# EAGLE design BIRDS_X_APRS_v1.3 (EAGLE 9.6.2)

## Sheet 1 of 3: MULTI-SPEC CAMERA MISSION
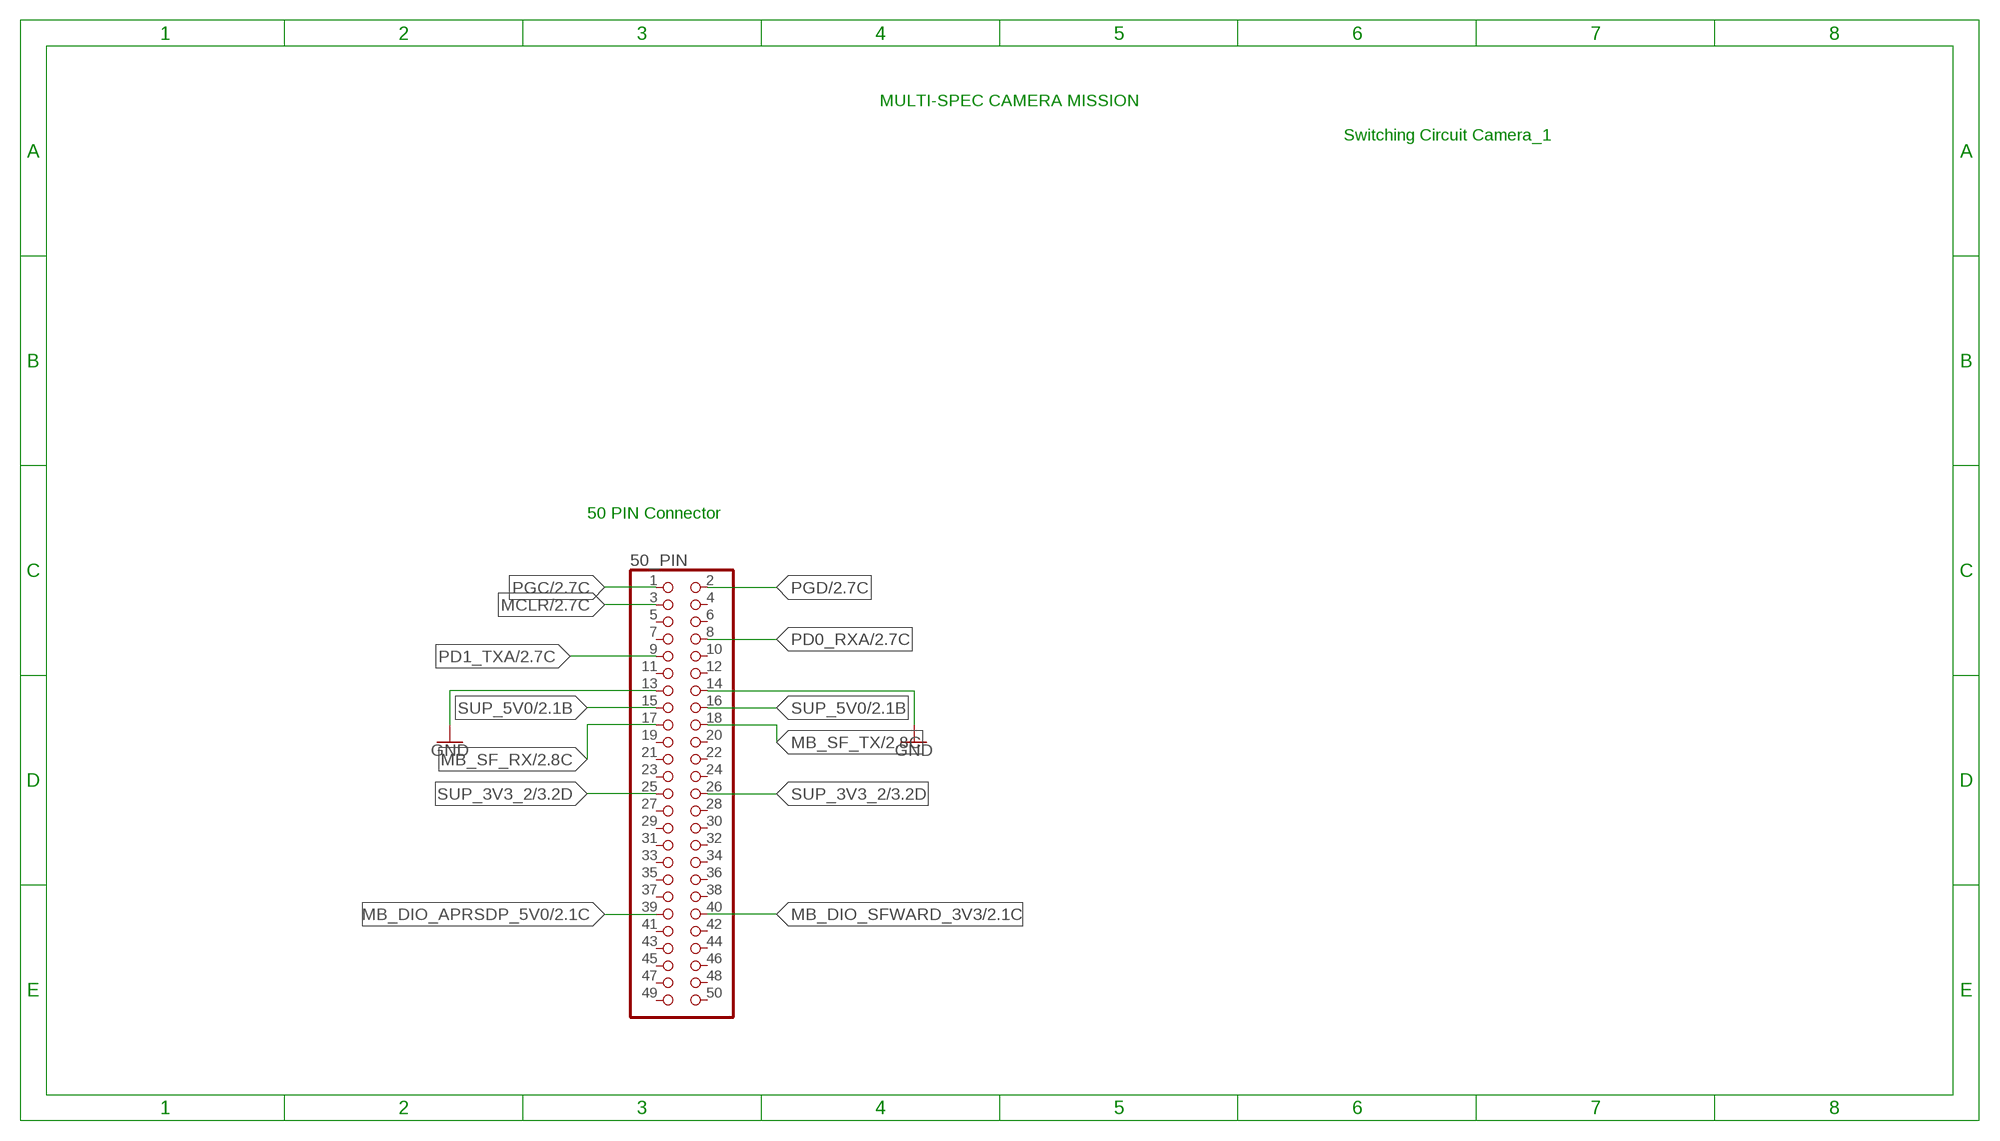
[diagram p0: schematic, sheet 1]

### Parts
50_PIN  PINHD-2X25_2.00  [2X25M]

### Nets
GND: 50_PIN.13 50_PIN.14 ; also sheet 2,3
MB_DIO_APRSDP_5V0: 50_PIN.39 ; also sheet 2
MB_DIO_SFWARD_3V3: 50_PIN.40 ; also sheet 2,3
MB_SF_RX/2.8C: 50_PIN.17
MB_SF_TX/2.8C: 50_PIN.18
MCLR: 50_PIN.3 ; also sheet 2,3
PD0_RXA: 50_PIN.8 ; also sheet 2
PD1_TXA: 50_PIN.9 ; also sheet 2
PGC: 50_PIN.1 ; also sheet 2,3
PGD: 50_PIN.2 ; also sheet 2,3
SUP_3V3_2: 50_PIN.25 50_PIN.26 ; also sheet 3
SUP_5V0: 50_PIN.15 50_PIN.16 ; also sheet 2
Unconnected: 50_PIN.4 50_PIN.5 50_PIN.6 50_PIN.7 50_PIN.10 50_PIN.11 50_PIN.12 50_PIN.19 50_PIN.20 50_PIN.21 50_PIN.22 50_PIN.23 50_PIN.24 50_PIN.27 50_PIN.28 50_PIN.29 50_PIN.30 50_PIN.31 50_PIN.32 50_PIN.33 50_PIN.34 50_PIN.35 50_PIN.36 50_PIN.37 50_PIN.38 50_PIN.41 50_PIN.42 50_PIN.43 50_PIN.44 50_PIN.45 50_PIN.46 50_PIN.47 50_PIN.48 50_PIN.49 50_PIN.50

### Notes on the sheet
- MULTI-SPEC CAMERA MISSION
- Switching Circuit Camera_1
- 50 PIN Connector

## Sheet 2 of 3: APRS/DP MISSION
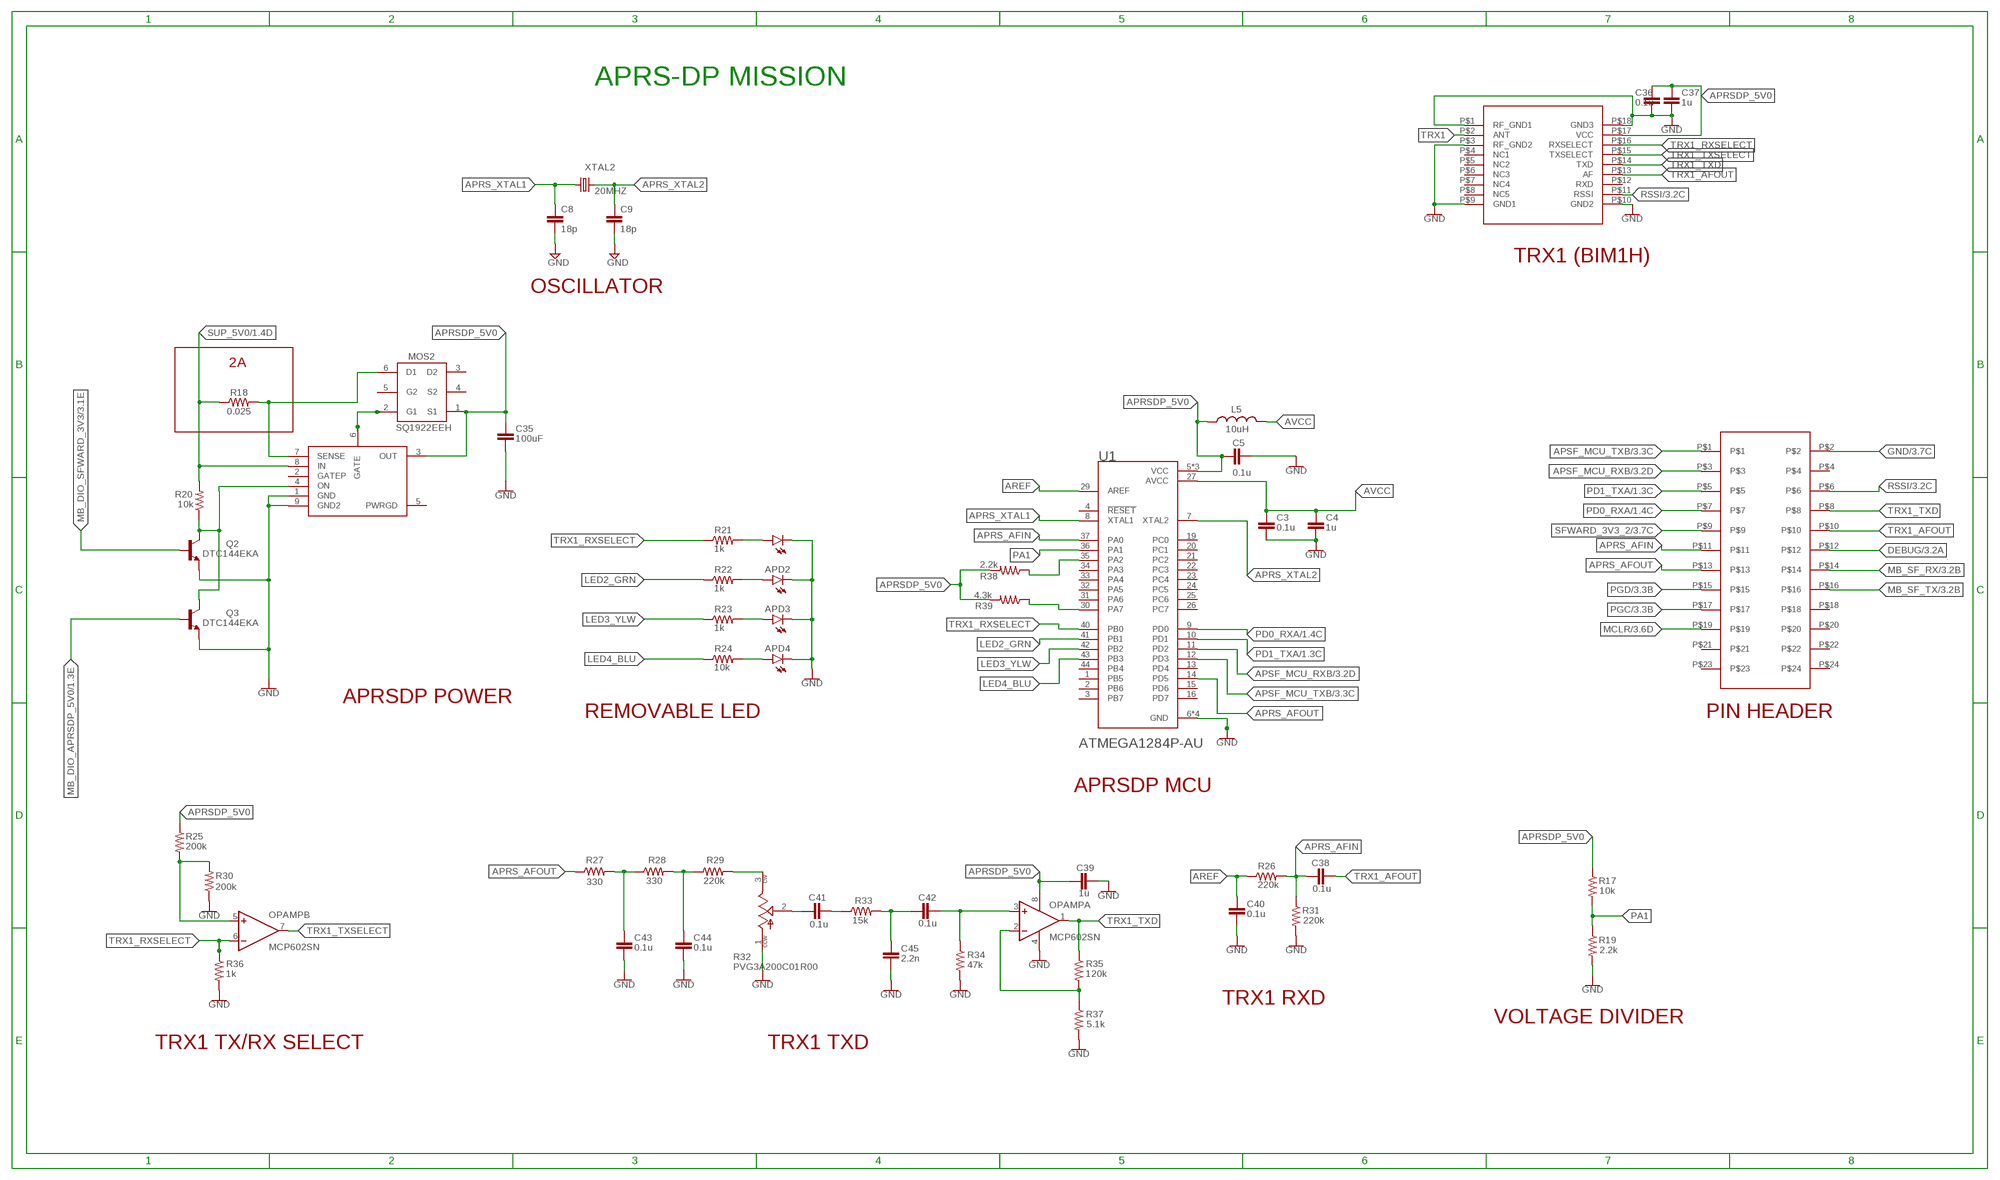
[diagram p1: schematic, sheet 2]

### Parts
APD1  LEDSML0603  [SML0603]
APD2  LEDSML0603  [SML0603]
APD3  LEDSML0603  [SML0603]
APD4  LEDSML0603  [SML0603]
C3  0.1u  CC0603  [C0603]
C4  1u  CC0603  [C0603]
C5  0.1u  CC0603  [C0603]
C8  18p  C  [C0805]
C9  18p  C  [C0805]
C35  100uF  C0805(2012)  [C0805]
C36  0.1u  CC0603  [C0603]
C37  1u  CC0603  [C0603]
C38  0.1u  CC0603  [C0603]
C39  1u  CC0603  [C0603]
C40  0.1u  CC0603  [C0603]
C41  0.1u  CC0603  [C0603]
C42  0.1u  CC0603  [C0603]
C43  0.1u  CC0603  [C0603]
C44  0.1u  CC0603  [C0603]
C45  2.2n  CC0603  [C0603]
JP1  RAB_ACCESS  [RAB_ACCESS]
L5  10uH  L-USL2012C  [L2012C]
MOS2  SQ1922EEH  [SOT65P210X110-6N]
OPAMP  MCP602SN  [SO08]
Q2  DTC144EKA  [SOT346-R]
Q3  DTC144EKA  [SOT346-R]
R17  10k  R-US_R0603  [R0603]
R18  0.025  R-US_R0805  [R0805]
R19  2.2k  R-US_R0603  [R0603]
R20  10k  R-US_R0603  [R0603]
R21  1k  R-US_R0603  [R0603]
R22  1k  R-US_R0603  [R0603]
R23  1k  R-US_R0603  [R0603]
R24  10k  R-US_R0603  [R0603]
R25  200k  R-US_R0603  [R0603]
R26  220k  R-US_R0603  [R0603]
R27  330  R-US_R0603  [R0603]
R28  330  R-US_R0603  [R0603]
R29  220k  R-US_R0603  [R0603]
R30  200k  R-US_R0603  [R0603]
R31  220k  R-US_R0603  [R0603]
R32  PVG3A200C01R00  [TRIM_PVG3A200C01R00]
R33  15k  R-US_R0603  [R0603]
R34  47k  R-US_R0603  [R0603]
R35  120k  R-US_R0603  [R0603]
R36  1k  R-US_R0603  [R0603]
R37  5.1k  R-US_R0603  [R0603]
R38  2.2k  R-US_R0603  [R0603]
R39  4.3k  R-US_R0603  [R0603]
TRX1  BIM1H  [BIM1H]
U1  ATMEGA1284P-AU  [QFP80P1200X1200X120-44N]
U$1  BIRDS5_LTC4361  [BIRDS5_LTC4361]
XTAL2  20MHZ  CRYSTALSM49  [SM49]

### Nets
APRS_AFIN: C38.1 JP1.P$11 R26.2 R31.1 U1.37(PA0)
APRS_AFOUT: JP1.P$13 R27.1 U1.14(PD5)
APRS_XTAL1: C8.1 U1.8(XTAL1) XTAL2.1
APRS_XTAL2: C9.1 U1.7(XTAL2) XTAL2.2
APRSDP_5V0: C5.2 C35.1 C36.1 C37.1 C39.1 L5.1 MOS2.1(S1) OPAMP.8(P:V+) R17.1 R25.1 R38.2 R39.2 TRX1.P$17(VCC) U1.5(VCC) U1.17(VCC) U1.38(VCC) U$1.3(OUT)
APSF_MCU_RXB: JP1.P$3 ; also sheet 3
APSF_MCU_RXB/3.2D: U1.11(PD2)
APSF_MCU_TXB: JP1.P$1 ; also sheet 3
APSF_MCU_TXB/3.3C: U1.12(PD3)
AREF: C40.1 R26.1 U1.29(AREF)
AVCC: C3.1 C4.1 L5.2 U1.27(AVCC)
DEBUG: JP1.P$12 ; also sheet 3
GATE4: MOS2.2(G1) U$1.6(GATE)
GND: APD1.C APD2.C APD3.C APD4.C C3.2 C4.2 C5.1 C8.2 C9.2 C35.2 C36.2 C37.2 C39.2 C40.2 C43.2 C44.2 C45.2 JP1.P$2 OPAMP.4(P:V-) Q2.1(E) Q3.1(E) R19.2 R30.1 R31.2 R32.1(CCW) R34.2 R36.2 R37.2 TRX1.P$1(RF_GND1) TRX1.P$3(RF_GND2) TRX1.P$9(GND1) TRX1.P$10(GND2) TRX1.P$18(GND3) U1.6(GND) U1.18(GND) U1.28(GND) U1.39(GND) U$1.1(GND) U$1.9(GND2) ; also sheet 1,3
LED2_GRN: R22.1 U1.41(PB1)
LED3_YLW: R23.1 U1.42(PB2)
LED4_BLU: R24.1 U1.43(PB3)
MB_DIO_APRSDP_5V0: Q3.2(B) ; also sheet 1
MB_DIO_SFWARD_3V3: Q2.2(B) ; also sheet 1,3
MB_SF_RX: JP1.P$14 ; also sheet 3
MB_SF_TX: JP1.P$16 ; also sheet 3
MCLR: JP1.P$19 ; also sheet 1,3
N$1: R38.1 U1.35(PA2)
N$3: R39.1 U1.30(PA7)
N$10: R29.2 R32.3(CW)
N$12: APD1.A R21.2
N$13: APD2.A R22.2
N$14: APD3.A R23.2
N$15: APD4.A R24.2
N$16: C43.1 R27.2 R28.1
N$17: C44.1 R28.2 R29.1
N$18: C42.1 C45.1 R33.2
N$19: C41.2 R33.1
N$20: OPAMP.2(A:-IN) R35.2 R37.1
N$21: OPAMP.5(B:+IN) R25.2 R30.2
N$22: C41.1 R32.2(WIPER)
ON4: Q2.3(C) Q3.3(C) R20.1 U$1.4(ON)
OPAMP_A+: C42.2 OPAMP.3(A:+IN) R34.1
PA1: R17.2 R19.1 U1.36(PA1)
PD0_RXA: JP1.P$7 ; also sheet 1
PD0_RXA/1.4C: U1.9(PD0)
PD1_TXA: JP1.P$5 ; also sheet 1
PD1_TXA/1.3C: U1.10(PD1)
PGC: JP1.P$17 ; also sheet 1,3
PGD: JP1.P$15 ; also sheet 1,3
RSSI: JP1.P$6 TRX1.P$11(RSSI) ; also sheet 3
SENSE4: MOS2.6(D1) R18.2 U$1.7(SENSE)
SFWARD_3V3_2: JP1.P$9 ; also sheet 3
SUP_5V0: R18.1 R20.2 U$1.8(IN) ; also sheet 1
TRX1: TRX1.P$2(ANT) ; also sheet 3
TRX1_AFOUT: C38.2 JP1.P$10 TRX1.P$13(AF)
TRX1_RXSELECT: OPAMP.6(B:-IN) R21.1 R36.1 TRX1.P$16(RXSELECT) U1.40(PB0)
TRX1_TXD: JP1.P$8 OPAMP.1(A:OUT) R35.1 TRX1.P$14(TXD)
TRX1_TXSELECT: OPAMP.7(B:OUT) TRX1.P$15(TXSELECT)
Unconnected: JP1.P$4 JP1.P$18 JP1.P$20 JP1.P$21 JP1.P$22 JP1.P$23 JP1.P$24 MOS2.3(D2) MOS2.4(S2) MOS2.5(G2) TRX1.P$4(NC1) TRX1.P$5(NC2) TRX1.P$6(NC3) TRX1.P$7(NC4) TRX1.P$8(NC5) TRX1.P$12(RXD) U1.1(PB5) U1.2(PB6) U1.3(PB7) U1.4(!RESET) U1.13(PD4) U1.15(PD6) U1.16(PD7) U1.19(PC0) U1.20(PC1) U1.21(PC2) U1.22(PC3) U1.23(PC4) U1.24(PC5) U1.25(PC6) U1.26(PC7) U1.31(PA6) U1.32(PA5) U1.33(PA4) U1.34(PA3) U1.44(PB4) U$1.2(GATEP) U$1.5(PWRGD)

### Notes on the sheet
- APRS-DP MISSION
- TRX1 (BIM1H)
- OSCILLATOR
- 2A
- APRSDP POWER
- REMOVABLE LED | PIN HEADER
- APRSDP MCU
- TRX1 RXD
- VOLTAGE DIVIDER
- TRX1 TX/RX SELECT | TRX1 TXD

## Sheet 3 of 3: SF-WARD MISSION
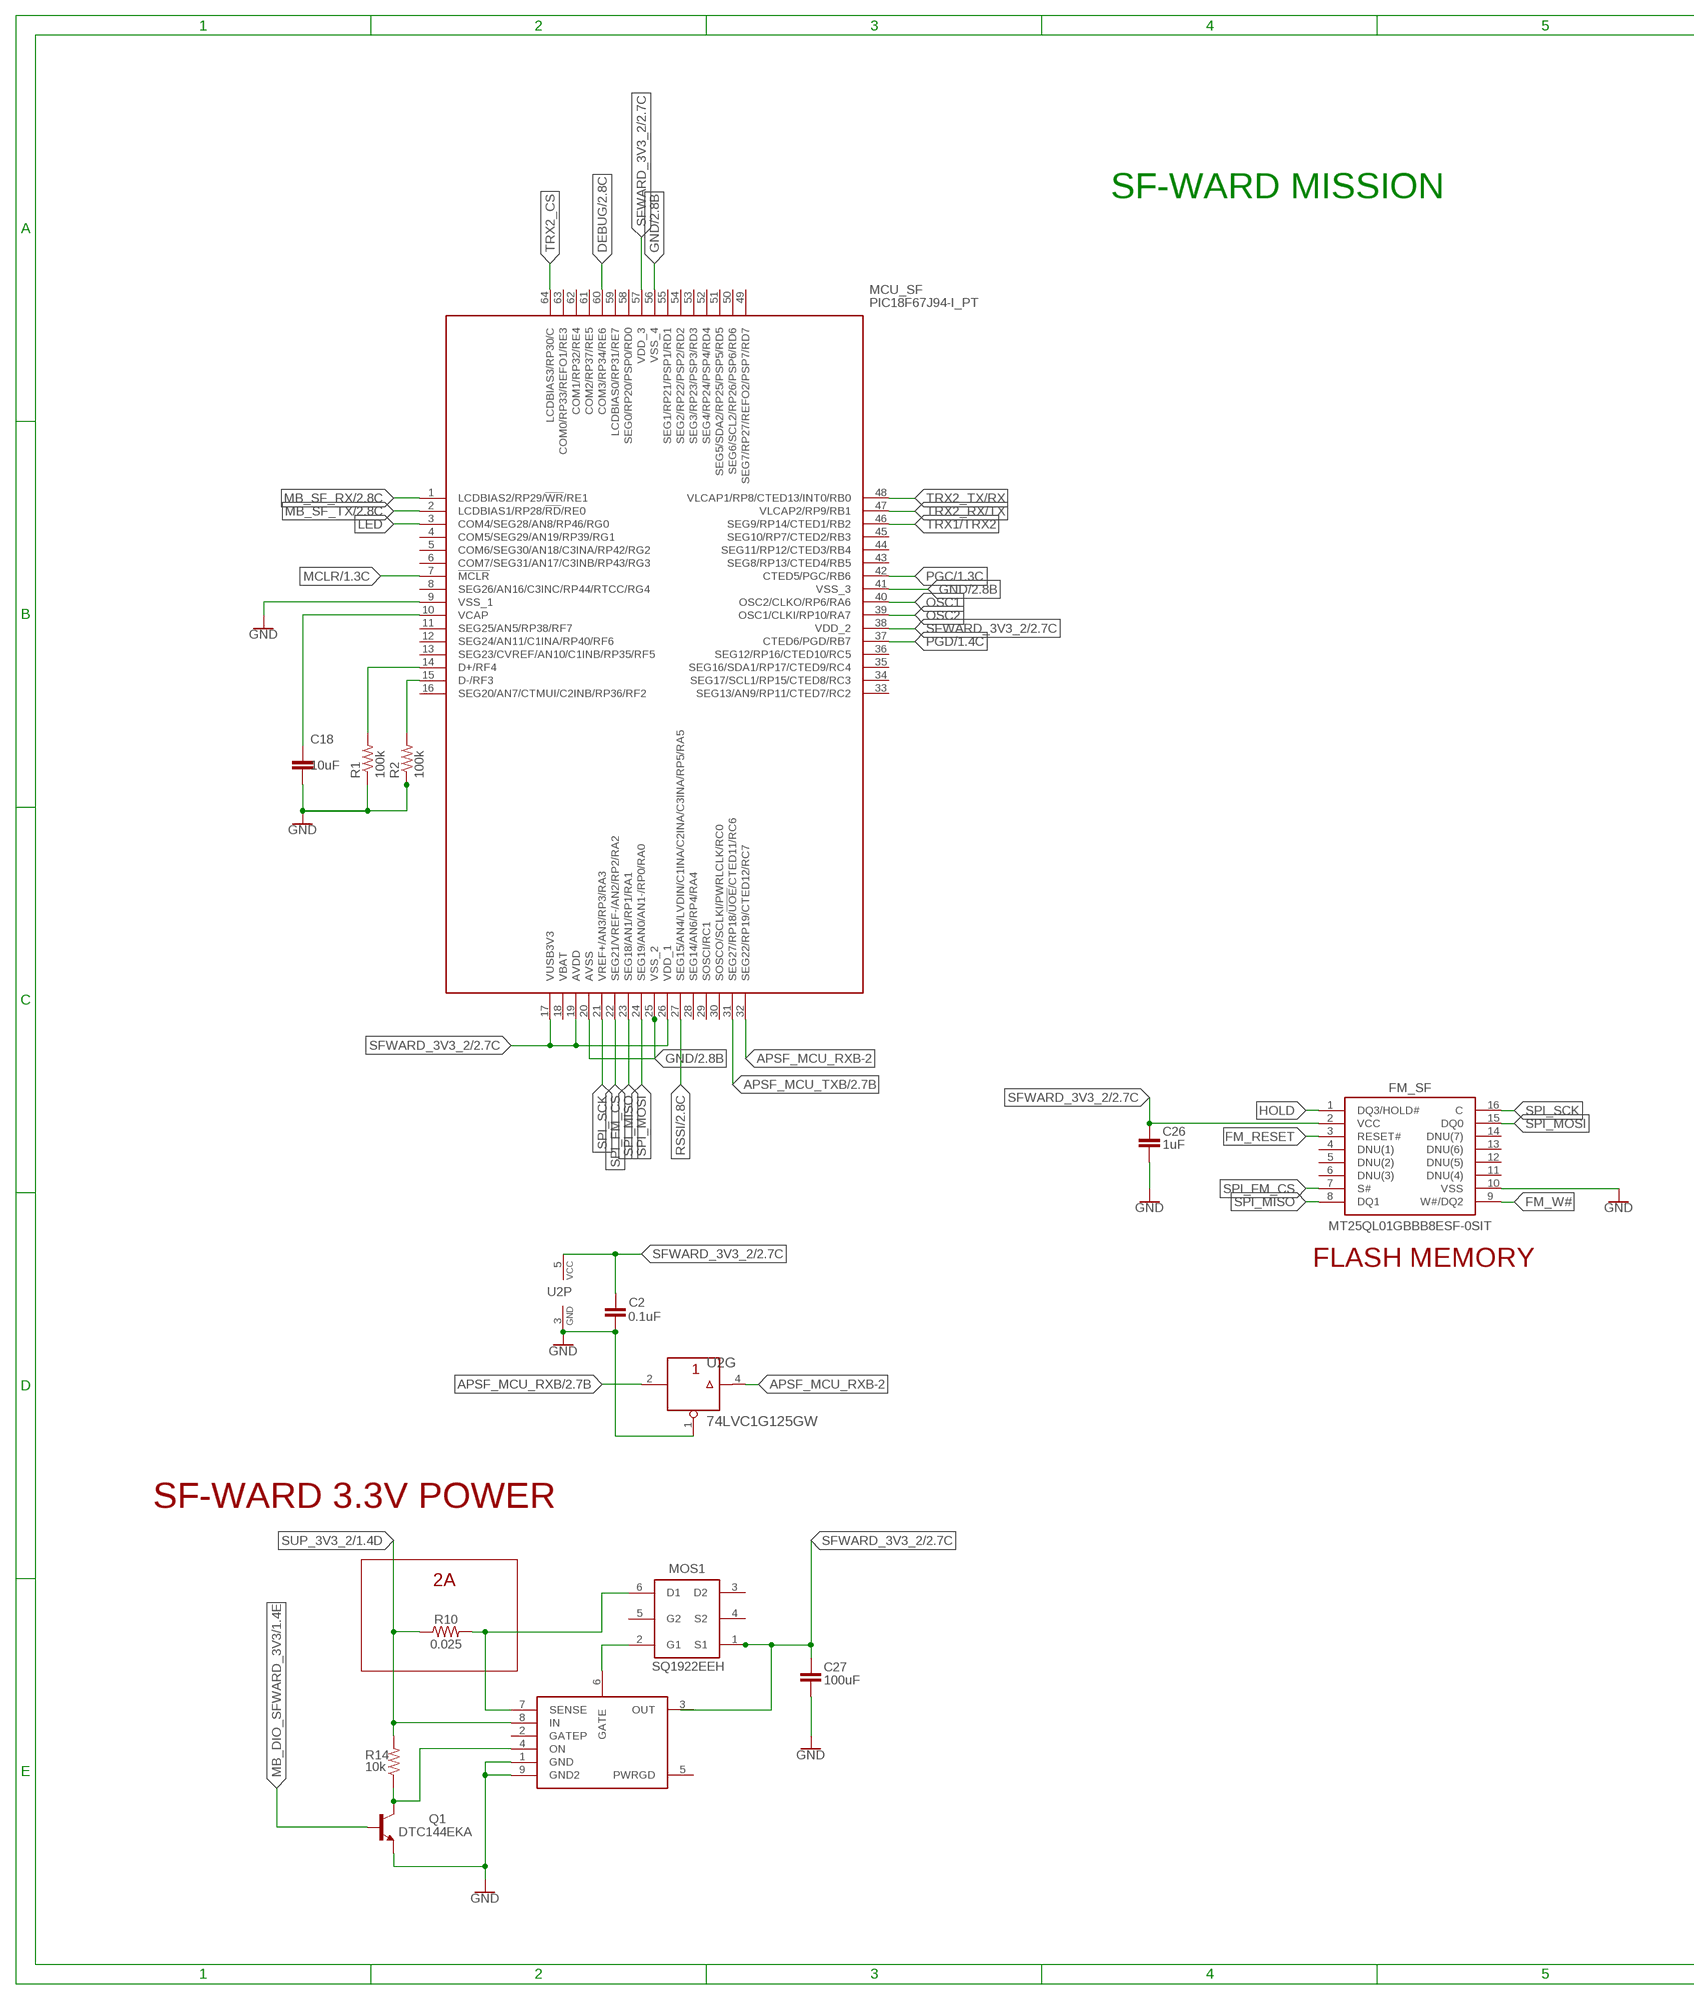
[diagram p2: schematic, sheet 3, part 1 of 2]
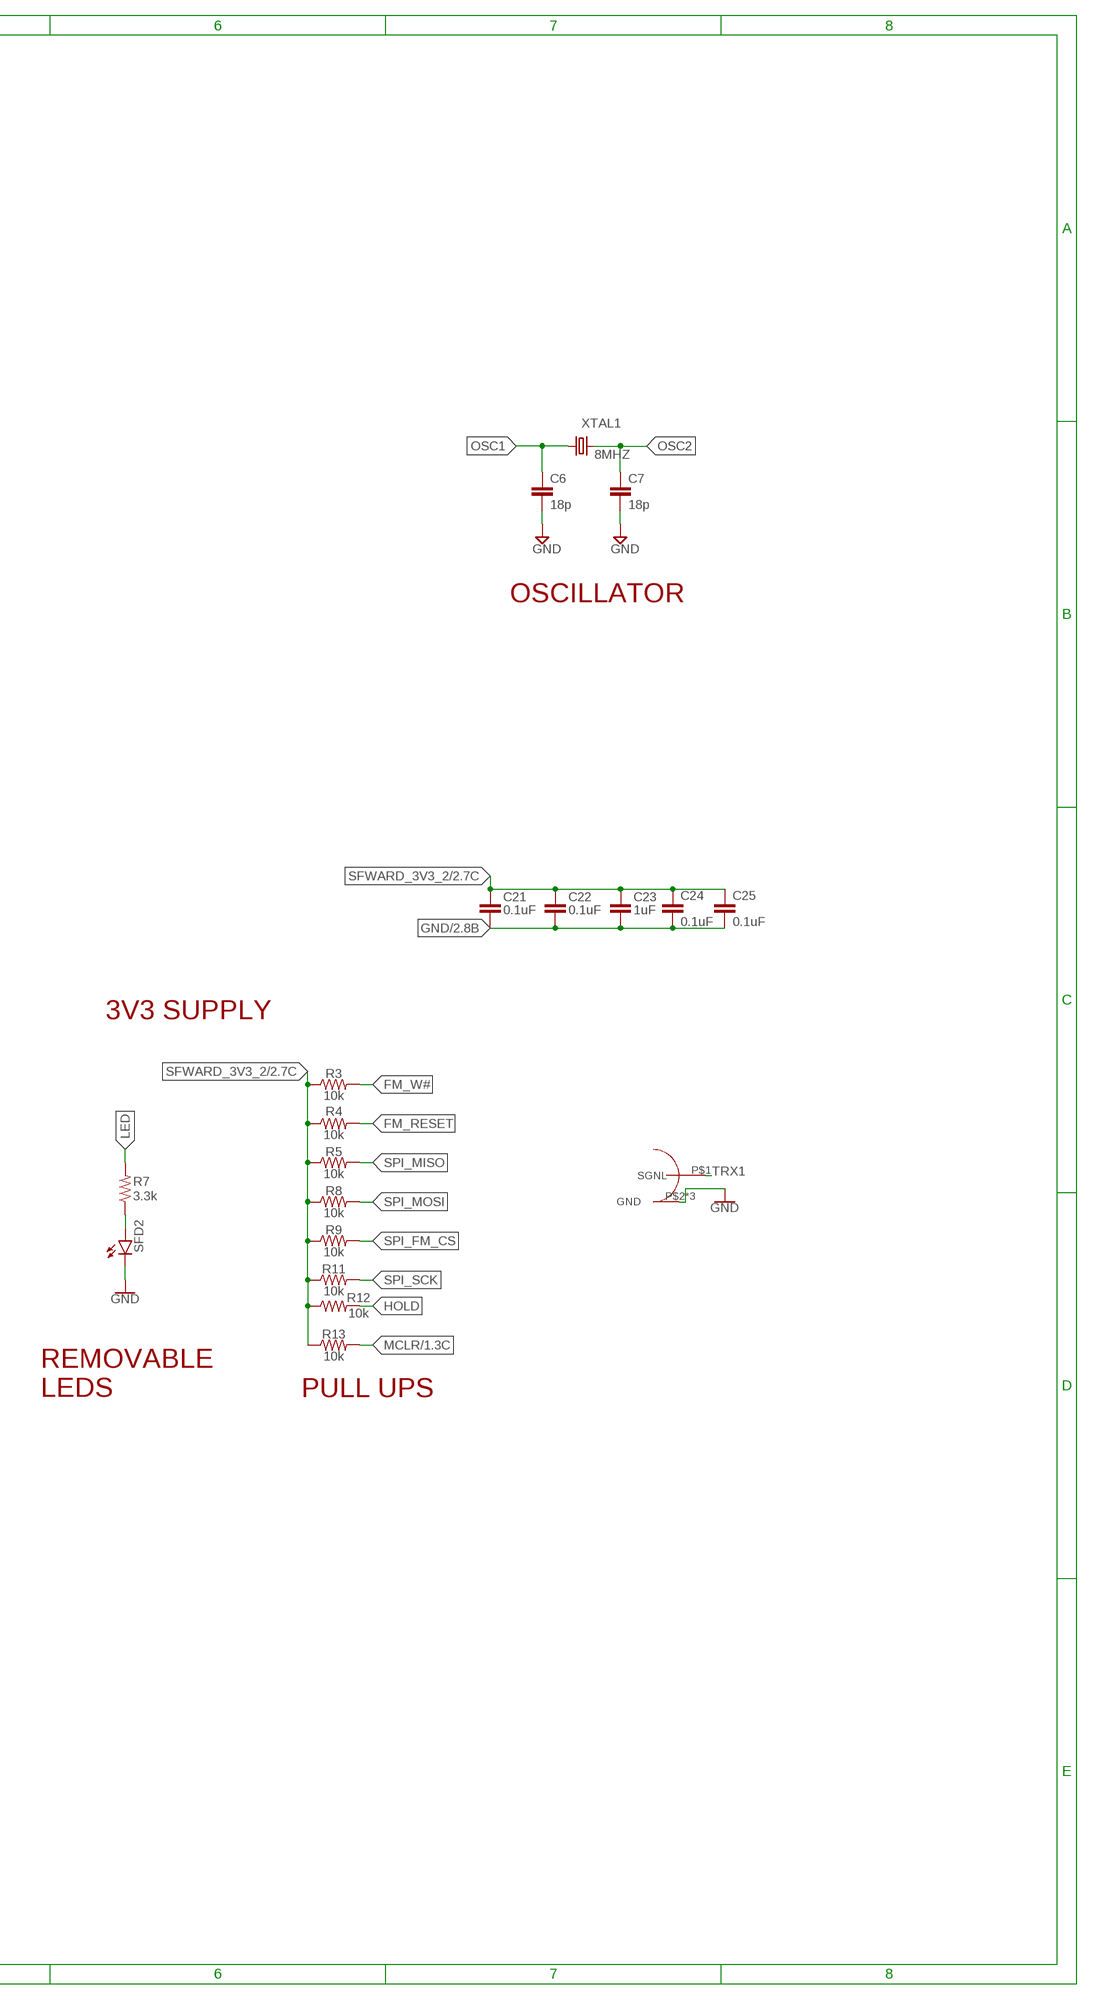
[diagram p3: schematic, sheet 3, part 2 of 2]

### Parts
C2  0.1uF  CC0603  [C0603]
C6  18p  C  [C0805]
C7  18p  C  [C0805]
C18  10uF  C-EUC0603  [C0603]
C21  0.1uF  C-EUC0603  [C0603]
C22  0.1uF  C-EUC0603  [C0603]
C23  1uF  C-EUC0603  [C0603]
C24  0.1uF  C-EUC0603  [C0603]
C25  0.1uF  C-EUC0603  [C0603]
C26  1uF  C-EUC0603  [C0603]
C27  100uF  C0805(2012)  [C0805]
FM_SF  MT25QL01GBBB8ESF-0SIT  [SOIC127P1032X265-16N]
MCU_SF  PIC18F67J94-I_PT  [QFP50P1200X1200X120-64N]
MMCX_908_222101T  MMCX_908_222101T  [MMCX_908_222101T]
MOS1  SQ1922EEH  [SOT65P210X110-6N]
Q1  DTC144EKA  [SOT346-R]
R1  100k  R-US_R0603  [R0603]
R2  100k  R-US_R0603  [R0603]
R3  10k  R-US_R0603  [R0603]
R4  10k  R-US_R0603  [R0603]
R5  10k  R-US_R0603  [R0603]
R7  3.3k  R-US_R0603  [R0603]
R8  10k  R-US_R0603  [R0603]
R9  10k  R-US_R0603  [R0603]
R10  0.025  R0805(2012)  [R0805]
R11  10k  R-US_R0603  [R0603]
R12  10k  R-US_R0603  [R0603]
R13  10k  R-US_R0603  [R0603]
R14  10k  R-US_R0603  [R0603]
SFD2  LEDCHIPLED_0603  [CHIPLED_0603]
U2  74LVC1G125GW  [SOT353-1]
U$3  BIRDS5_LTC4361  [BIRDS5_LTC4361]
XTAL1  8MHZ  CRYSTALSM49  [SM49]

### Nets
APSF_MCU_RXB: U2.2(G:A) ; also sheet 2
APSF_MCU_RXB-2: MCU_SF.32(SEG22/RP19/CTED12/RC7) U2.4(G:Y)
APSF_MCU_TXB: MCU_SF.31(SEG27/RP18/!UOE!/CTED11/RC6) ; also sheet 2
DEBUG: MCU_SF.60(COM3/RP34/RE6) ; also sheet 2
FM_RESET: FM_SF.3(RESET#) R4.2
FM_W#: FM_SF.9(W#/DQ2) R3.2
GATE3: MOS1.2(G1) U$3.6(GATE)
GND: C2.1 C6.2 C7.2 C18.2 C21.2 C22.2 C23.2 C24.2 C25.2 C26.2 C27.2 FM_SF.10(VSS) MCU_SF.9(VSS_1) MCU_SF.20(AVSS) MCU_SF.25(VSS_2) MCU_SF.41(VSS_3) MCU_SF.56(VSS_4) MMCX_908_222101T.P$2(GND) MMCX_908_222101T.P$3(GND) MMCX_908_222101T.P$4(GND) Q1.1(E) R1.1 R2.1 SFD2.C U2.1(G:OEN) U2.3(P:GND) U$3.1(GND) U$3.9(GND2) ; also sheet 1,2
HOLD: FM_SF.1(DQ3/HOLD#) R12.2
LED: MCU_SF.3(COM4/SEG28/AN8/RP46/RG0) R7.2
MB_DIO_SFWARD_3V3: Q1.2(B) ; also sheet 1,2
MB_SF_RX: MCU_SF.1(LCDBIAS2/RP29/!WR!/RE1) ; also sheet 2
MB_SF_TX: MCU_SF.2(LCDBIAS1/RP28/!RD!/RE0) ; also sheet 2
MCLR: MCU_SF.7(!MCLR) R13.2 ; also sheet 1,2
N$2: C18.1 MCU_SF.10(VCAP)
N$7: MCU_SF.14(D+/RF4) R1.2
N$8: MCU_SF.15(D-/RF3) R2.2
N$11: R7.1 SFD2.A
ON3: Q1.3(C) R14.1 U$3.4(ON)
OSC1: C6.1 MCU_SF.40(OSC2/CLKO/RP6/RA6) XTAL1.1
OSC2: C7.1 MCU_SF.39(OSC1/CLKI/RP10/RA7) XTAL1.2
PGC: MCU_SF.42(CTED5/PGC/RB6) ; also sheet 1,2
PGD: MCU_SF.37(CTED6/PGD/RB7) ; also sheet 1,2
RSSI: MCU_SF.27(SEG15/AN4/LVDIN/C1INA/C2INA/C3INA/RP5/RA5) ; also sheet 2
SENSE3: MOS1.6(D1) R10.2 U$3.7(SENSE)
SFWARD_3V3_2: C2.2 C21.1 C22.1 C23.1 C24.1 C25.1 C26.1 C27.1 FM_SF.2(VCC) MCU_SF.17(VUSB3V3) MCU_SF.19(AVDD) MCU_SF.26(VDD_1) MCU_SF.38(VDD_2) MCU_SF.57(VDD_3) MOS1.1(S1) R3.1 R4.1 R5.1 R8.1 R9.1 R11.1 R12.1 R13.1 U2.5(P:VCC) U$3.3(OUT) ; also sheet 2
SPI_FM_CS: FM_SF.7(S#) MCU_SF.22(SEG21/VREF-/AN2/RP2/RA2) R9.2
SPI_MISO: FM_SF.8(DQ1) MCU_SF.23(SEG18/AN1/RP1/RA1) R5.2
SPI_MOSI: FM_SF.15(DQ0) MCU_SF.24(SEG19/AN0/AN1-/RP0/RA0) R8.2
SPI_SCK: FM_SF.16(C) MCU_SF.21(VREF+/AN3/RP3/RA3) R11.2
SUP_3V3_2: R10.1 R14.2 U$3.8(IN) ; also sheet 1
TRX1: MMCX_908_222101T.P$1(SGNL) ; also sheet 2
TRX1/TRX2: MCU_SF.46(SEG9/RP14/CTED1/RB2)
TRX2_CS: MCU_SF.64(LCDBIAS3/RP30/C)
TRX2_RX/TX: MCU_SF.47(VLCAP2/RP9/RB1)
TRX2_TX/RX: MCU_SF.48(VLCAP1/RP8/CTED13/INT0/RB0)
Unconnected: FM_SF.4(DNU(1)) FM_SF.5(DNU(2)) FM_SF.6(DNU(3)) FM_SF.11(DNU(4)) FM_SF.12(DNU(5)) FM_SF.13(DNU(6)) FM_SF.14(DNU(7)) MCU_SF.4(COM5/SEG29/AN19/RP39/RG1) MCU_SF.5(COM6/SEG30/AN18/C3INA/RP42/RG2) MCU_SF.6(COM7/SEG31/AN17/C3INB/RP43/RG3) MCU_SF.8(SEG26/AN16/C3INC/RP44/RTCC/RG4) MCU_SF.11(SEG25/AN5/RP38/RF7) MCU_SF.12(SEG24/AN11/C1INA/RP40/RF6) MCU_SF.13(SEG23/CVREF/AN10/C1INB/RP35/RF5) MCU_SF.16(SEG20/AN7/CTMUI/C2INB/RP36/RF2) MCU_SF.18(VBAT) MCU_SF.28(SEG14/AN6/RP4/RA4) MCU_SF.29(SOSCI/RC1) MCU_SF.30(SOSCO/SCLKI/PWRLCLK/RC0) MCU_SF.33(SEG13/AN9/RP11/CTED7/RC2) MCU_SF.34(SEG17/SCL1/RP15/CTED8/RC3) MCU_SF.35(SEG16/SDA1/RP17/CTED9/RC4) MCU_SF.36(SEG12/RP16/CTED10/RC5) MCU_SF.43(SEG8/RP13/CTED4/RB5) MCU_SF.44(SEG11/RP12/CTED3/RB4) MCU_SF.45(SEG10/RP7/CTED2/RB3) MCU_SF.49(SEG7/RP27/REFO2/PSP7/RD7) MCU_SF.50(SEG6/SCL2/RP26/PSP6/RD6) MCU_SF.51(SEG5/SDA2/RP25/PSP5/RD5) MCU_SF.52(SEG4/RP24/PSP4/RD4) MCU_SF.53(SEG3/RP23/PSP3/RD3) MCU_SF.54(SEG2/RP22/PSP2/RD2) MCU_SF.55(SEG1/RP21/PSP1/RD1) MCU_SF.58(SEG0/RP20/PSP0/RD0) MCU_SF.59(LCDBIAS0/RP31/RE7) MCU_SF.61(COM2/RP37/RE5) MCU_SF.62(COM1/RP32/RE4) MCU_SF.63(COM0/RP33/REFO1/RE3) MOS1.3(D2) MOS1.4(S2) MOS1.5(G2) U$3.2(GATEP) U$3.5(PWRGD)

### Notes on the sheet
- SF-WARD MISSION
- OSCILLATOR
- 3V3 SUPPLY
- FLASH MEMORY
- REMOVABLE
  LEDS
- PULL UPS
- SF-WARD 3.3V POWER
- 2A

## Library data of the parts
50_PIN = pinhead-1:PINHD-2X25: PIN HEADER
APD1-APD4 SFD2 = led:LED: LED OSRAM: - CHIPLED LG R971, LG N971, LY N971, LG Q971, LY Q971, LO R971, LY R971 LH N974, LH R974 LS Q976, LO Q976, LY Q976 LO Q996 - Hyper CHIPLED LW Q18S LB Q993, LB Q99A, LB R99A - SideLED LS A670, LO A670, LY A670, LG A670, LP A670 LB A673, LV A673, LT A673, LW A673 LH A674 LY A675 LS A676, LA A676, LO A676, LY A676, LW A676 LS A679, LY A679, LG A679 - Hyper Micro SIDELED® LS Y876, LA Y876, LO Y876, LY Y876 LT Y87S - SmartLED LW L88C, LW L88S LB L89C, LB L89S, LG L890 LS L89K, LO L89K, LY L89K LS L896, LA L896, LO L896, LY L896 - TOPLED LS T670, LO T670, LY T670, LG T670, LP T670 LSG T670, LSP T670, LSY T670, LOP T670, LYG T670 LG T671, LOG T671, LSG T671 LB T673, LV T673, LT T673, LW T673 LH T674 LS T676, LA T676, LO T676, LY T676, LB T676, LH T676, LSB T676, LW T676 LB T67C, LV T67C, LT T67C, LS T67K, LO T67K, LY T67K, LW E67C LS E67B, LA E67B, LO E67B, LY E67B, LB E67C, LV E67C, LT E67C LW T67C LS T679, LY T679, LG T679 LS T770, LO T770, LY T770, LG T770, LP T770 LB T773, LV T773, LT T773, LW T773 LH T774 LS E675, LA E675, LY E675, LS T675 LS T776, LA T776, LO T776, LY T776, LB T776 LHGB T686 LT T68C, LB T68C - Hyper Mini TOPLED® LB M676 - Mini TOPLED Santana® LG M470 LS M47K, LO M47K, LY M47K Source: http://www.osram.convergy.de LUXEON: - LUMILED® LXK2-PW12-R00, LXK2-PW12-S00, LXK2-PW14-U00, LXK2-PW14-V00 LXK2-PM12-R00, LXK2-PM12-S00, LXK2-PM14-U00 LXK2-PE12-Q00, LXK2-PE12-R00, LXK2-PE12-S00, LXK2-PE14-T00, LXK2-PE14-U00 LXK2-PB12-K00, LXK2-PB12-L00, LXK2-PB12-M00, LXK2-PB14-N00, LXK2-PB14-P00, LXK2-PB14-Q00 LXK2-PR12-L00, LXK2-PR12-M00, LXK2-PR14-Q00, LXK2-PR14-R00 LXK2-PD12-Q00, LXK2-PD12-R00, LXK2-PD12-S00 LXK2-PH12-R00, LXK2-PH12-S00 LXK2-PL12-P00, LXK2-PL12-Q00, LXK2-PL12-R00 Source: www.luxeon.com KINGBRIGHT: KA-3528ASYC Source: www.kingbright.com
C2-C9 C36-C45 = eagle-ltspice:C: CAPACITOR, European symbol; SPICEMODEL: NONE; SPICEPREFIX: C
C18 C21-C26 = rcl:C-EU: CAPACITOR, European symbol; SPICEPREFIX: C
C27 C35 = BIRDS3_CAM_MSN:C0805(2012)
FM_SF = BIRDS3_CAM_MSN:MT25QL01GBBB8ESF-0SIT: IC FLASH 1GBIT 108MHZ 16SOIC Source: Datasheet <https://www.micron.com/~/media/documents/products/data-sheet/nor-flash/serial-nor/mt25q/die-rev-b/mt25q_qlkt_l_01g_bbb_0.pdf>; DESCRIPTION: IC FLASH 1GBIT 108MHZ 16SOIC; HEIGHT: 2.65mm; MANUFACTURER_NAME: Micron; MANUFACTURER_PART_NUMBER: MT25QL01GBBB8ESF-0SIT; SUPPLIER_NAME: RS
JP1 = BIRDS_4_general_components_library:RAB_ACCESS
L5 = rcl:L-US: INDUCTOR, American symbol; SPICEPREFIX: L
MCU_SF = PIC18F67J94-I_PT:PIC18F67J94-I_PT: MCU 8-Bit 128K Flash LCD USB XLP TQFP64 Microchip PIC18F67J94-I/PT, 8bit PIC Microcontroller, 64MHz, 128 kB Flash, 64-Pin TQFP Source: Datasheet <http://uk.rs-online.com/web/p/products/8233908>; ALLIED_NUMBER: 70470236; ALLIED_PRICE-STOCK: https://www.alliedelec.com/microchip-technology-inc-pic18f67j94-i-pt/70470236/; DESCRIPTION: MCU 8-Bit 128K Flash LCD USB XLP TQFP64 Microchip PIC18F67J94-I/PT, 8bit PIC Microcontroller, 64MHz, 128 kB Flash, 64-Pin TQFP; HEIGHT: 1.2mm; MANUFACTURER_NAME: Microchip; MANUFACTURER_PART_NUMBER: PIC18F67J94-I/PT; MOUSER_PART_NUMBER: 579-PIC18F67J94-I/PT; MOUSER_PRICE-STOCK: https://www.mouser.com/Search/Refine.aspx?Keyword=579-PIC18F67J94-I%2FPT; RS_PART_NUMBER: 1652172; RS_PRICE-STOCK: http://uk.rs-online.com/web/p/products/1652172
MMCX_908_222101T = BIRDS_4_general_components_library:MMCX_908_222101T
MOS1 MOS2 = BIRDS3_CAM_MSN:SQ1922EEH
OPAMP = linear:MCP602: Single Op Amp 2.7V to 6.0V Single Supply CMOS Source: http://ww1.microchip.com/downloads/en/DeviceDoc/21314g.pdf
Q1-Q3 = BIRDS3_CAM_MSN:DTC144EKA
R1-R5 R7-R9 R11-R14 R17-R31 R33-R39 = rcl:R-US_: RESISTOR, American symbol; SPICEPREFIX: R
R10 = BIRDS3_CAM_MSN:R0805(2012)
R32 = PVG3A200C01R00:PVG3A200C01R00: Res Cermet Trimmer 20 Ohm 20% 1/4W 1(Elec)/1(Mech)Turn 2.2mm (3.6 X 3.6 X 2mm) J-Hook SMD T/R; DESCRIPTION: Trimmer 20 Ohm 0.25w Smd; DIGI-KEY_PART_NUMBER: 490-2647-1-ND; DIGI-KEY_PURCHASE_URL: https://www.digikey.jp/product-detail/en/bourns-inc/PVG3A200C01R00/490-2647-1-ND/666223?utm_source=snapeda&utm_medium=aggregator&utm_campaign=symbol; MF: Bourns; MP: PVG3A200C01R00; PACKAGE: TO-221 Bourns
TRX1 = BIRDS_4_general_components_library:BIM1H
U1 = ATMEGA1284P-AU:ATMEGA1284P-AU: ATmega Series 20 MHz 128 KB Flash 16 KB SRAM 8-Bit Microcontroller - TQFP-44 Check availability <https://pricing.snapeda.com/parts/ATMEGA1284P-AU/Microchip/view-part?ref=eda>; AVAILABILITY: In Stock; DESCRIPTION: AVR AVR® ATmega Microcontroller IC 8-Bit 20MHz 128KB (64K x 16) FLASH 44-TQFP (10x10); MF: Microchip; MP: ATMEGA1284P-AU; PACKAGE: TQFP-44 Microchip; PRICE: None; PURCHASE-URL: https://pricing.snapeda.com/search/part/ATMEGA1284P-AU/?ref=eda
U2 = Buffers:74LVC1G125: Bus buffer/line driver; 3-state The 74LVC1G125 provides one non-inverting buffer/line driver with 3-state output. The 3-state output is controlled by the output enable input (OE). A HIGH-level at pin OE causes the output to assume a high-impedance OFF-state. The input can be driven from either 3.3 V or 5 V devices. This feature allows the use of this device in a mixed 3.3 V and 5 V environment. This device is fully specified for partial power-down applications using IOFF. The IOFF circuitry disables the output, preventing the damaging backflow current through the device when it is powered down. AAL Eindhoven MK
U$1 U$3 = BIRDS5_LTC4361:BIRDS5_LTC4361
XTAL1 XTAL2 = crystal:CRYSTAL: CRYSTAL; OC_FARNELL: unknown; OC_NEWARK: unknown

## Board
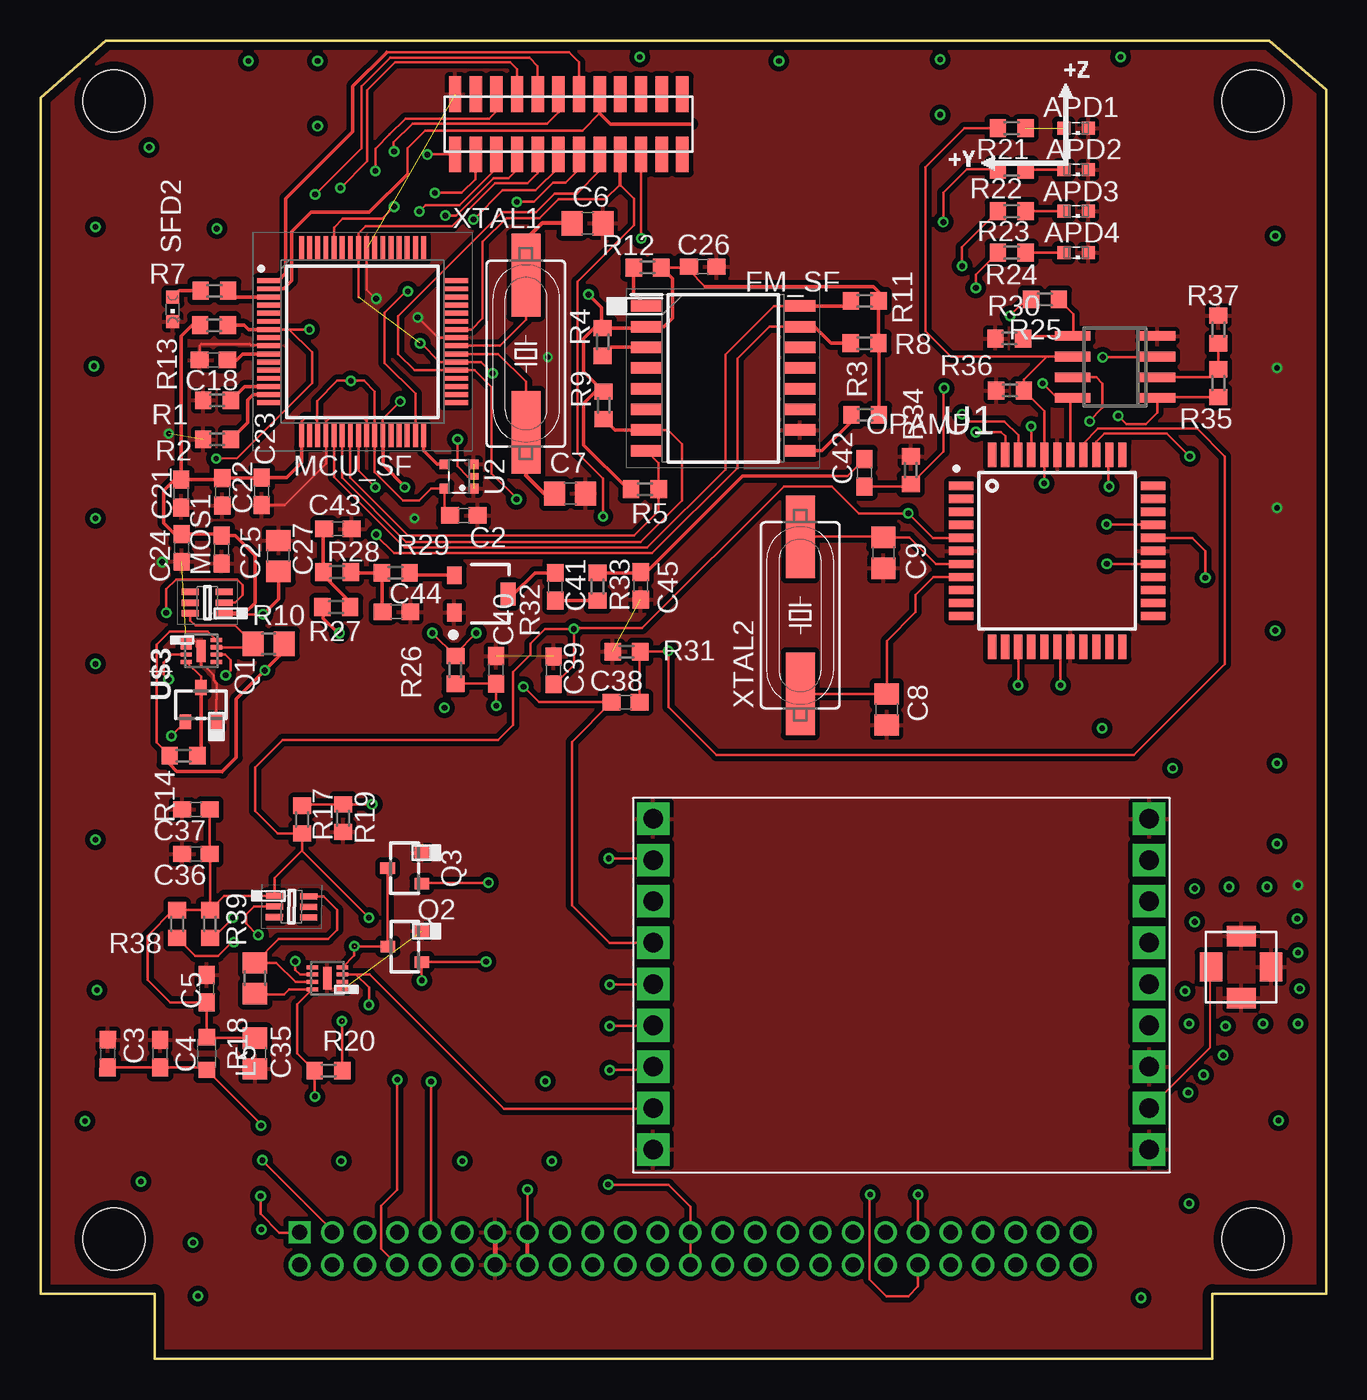
[diagram p4: board, top side]
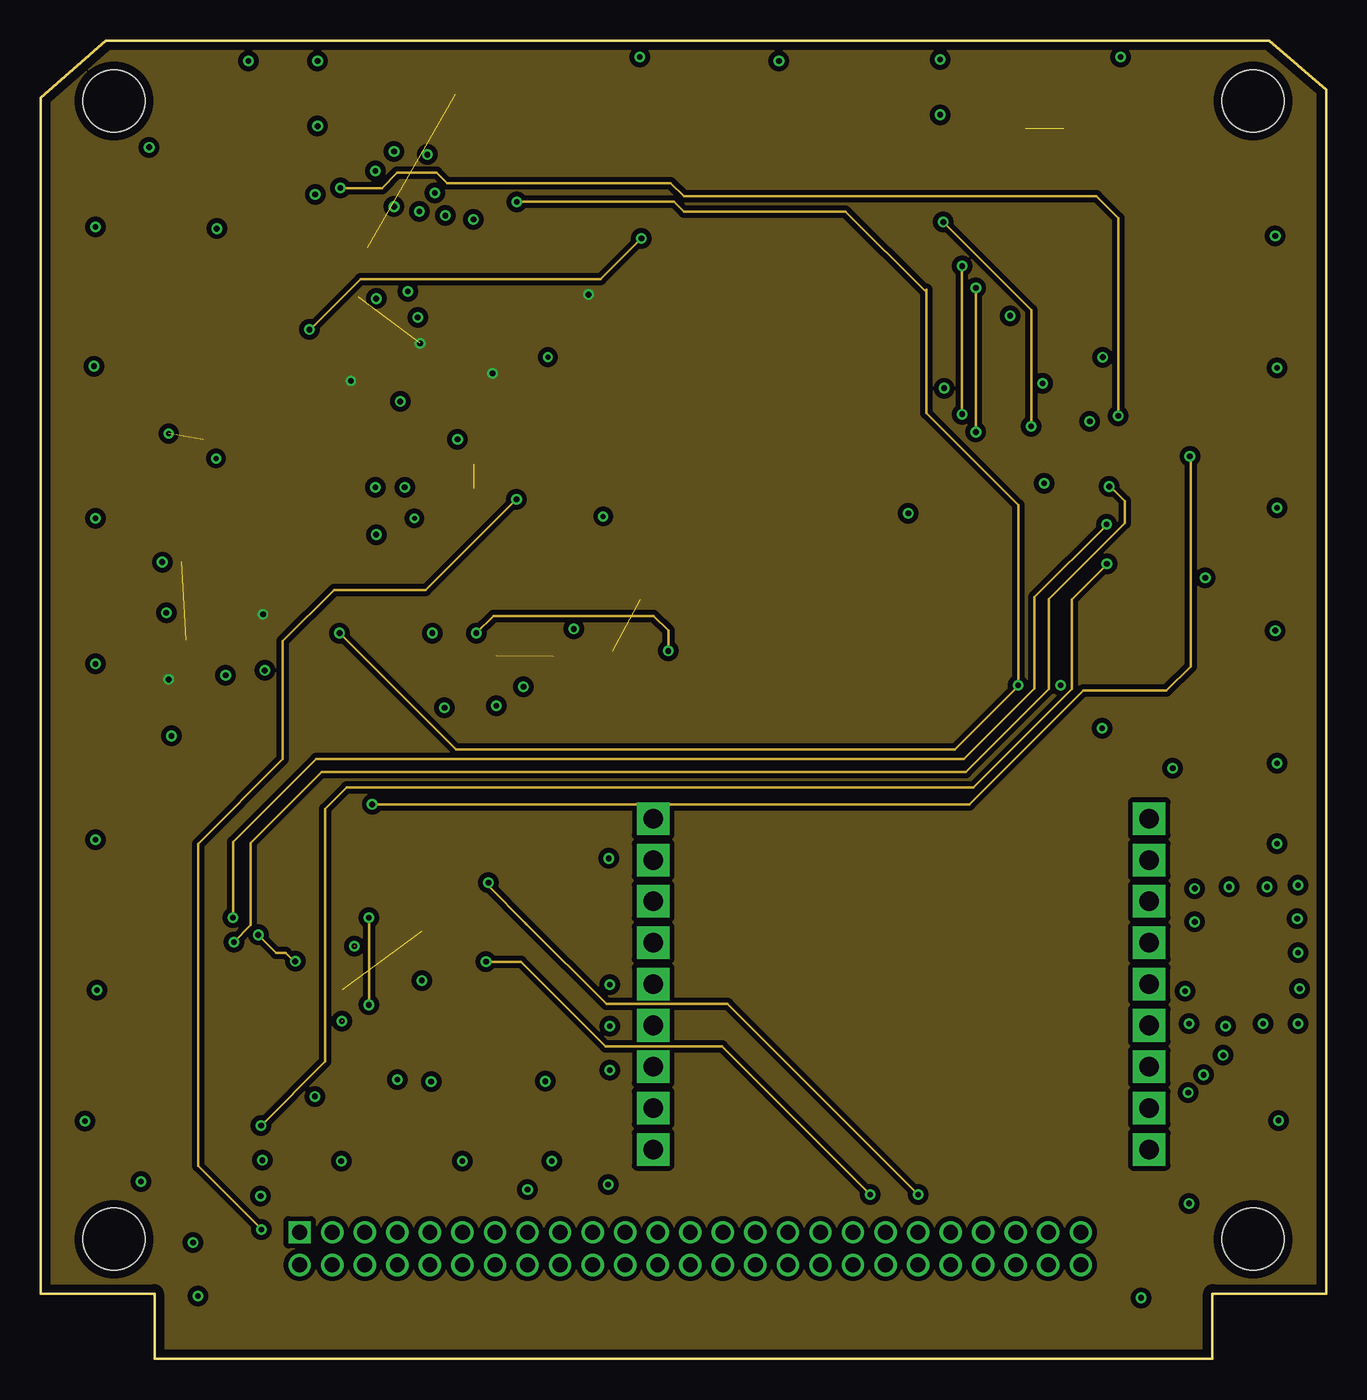
[diagram p5: board, inner layer Route2]
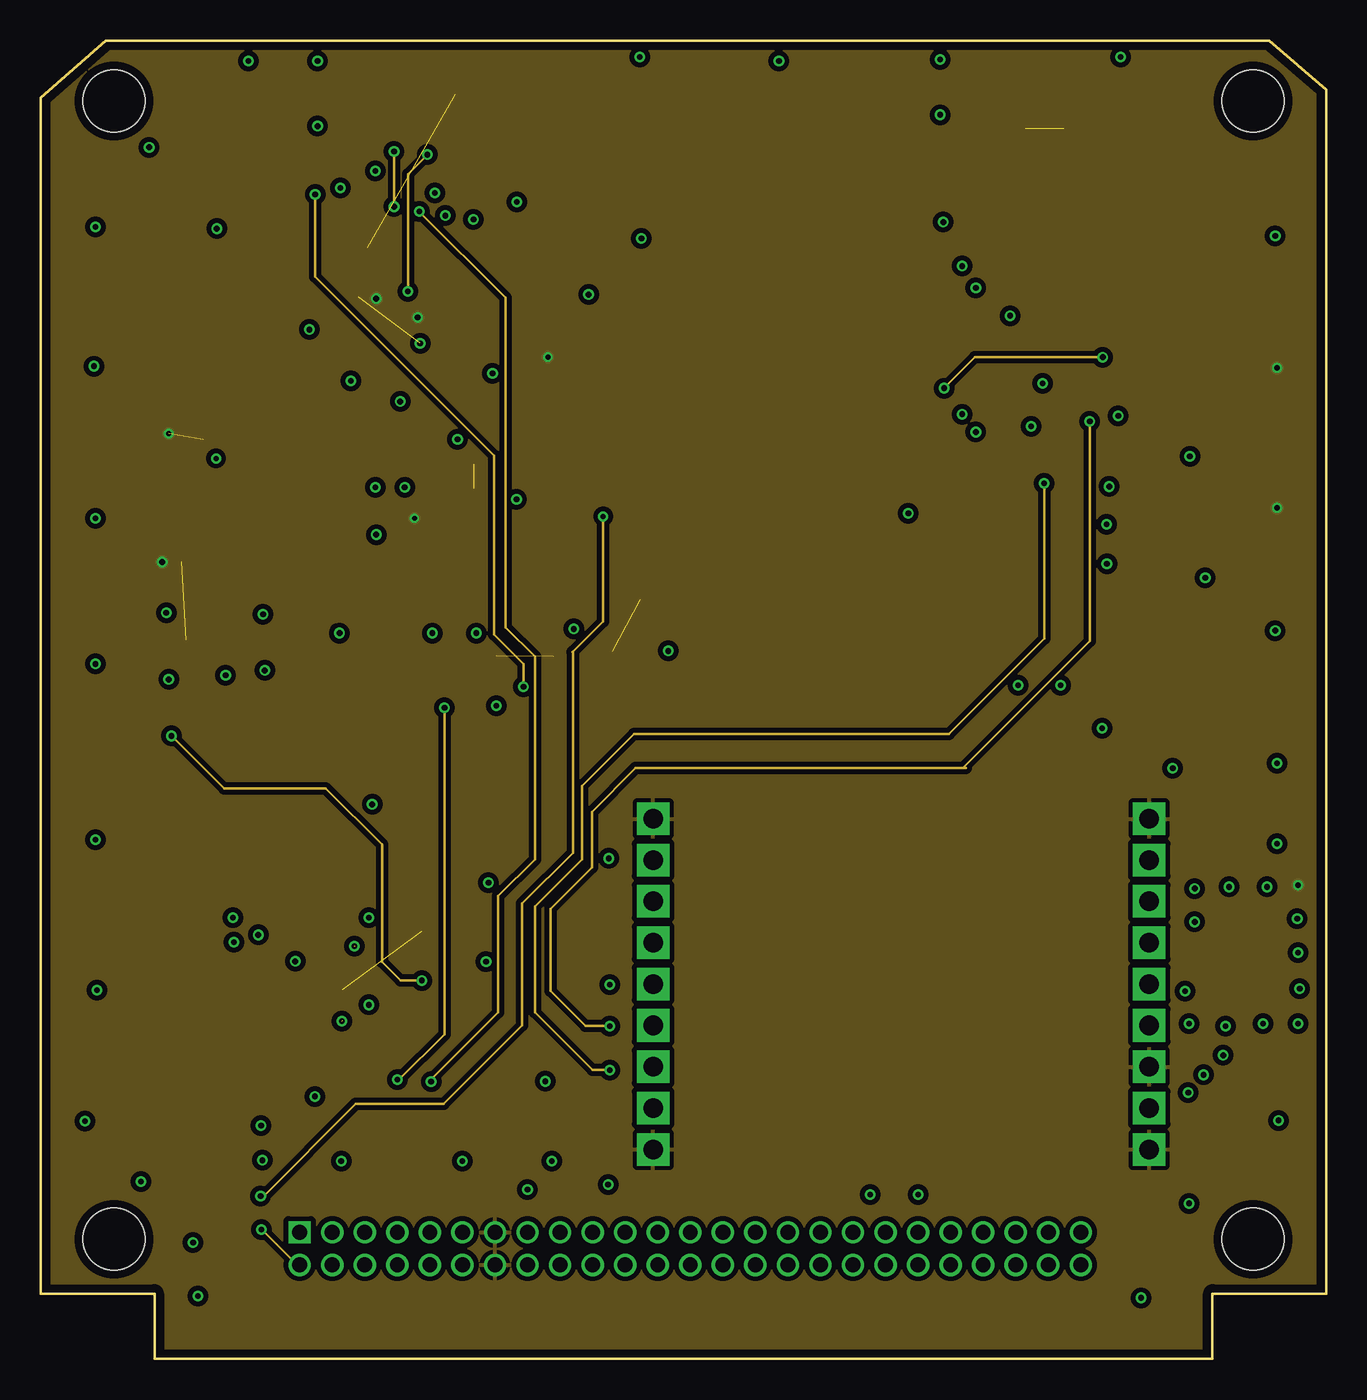
[diagram p6: board, inner layer Route15]
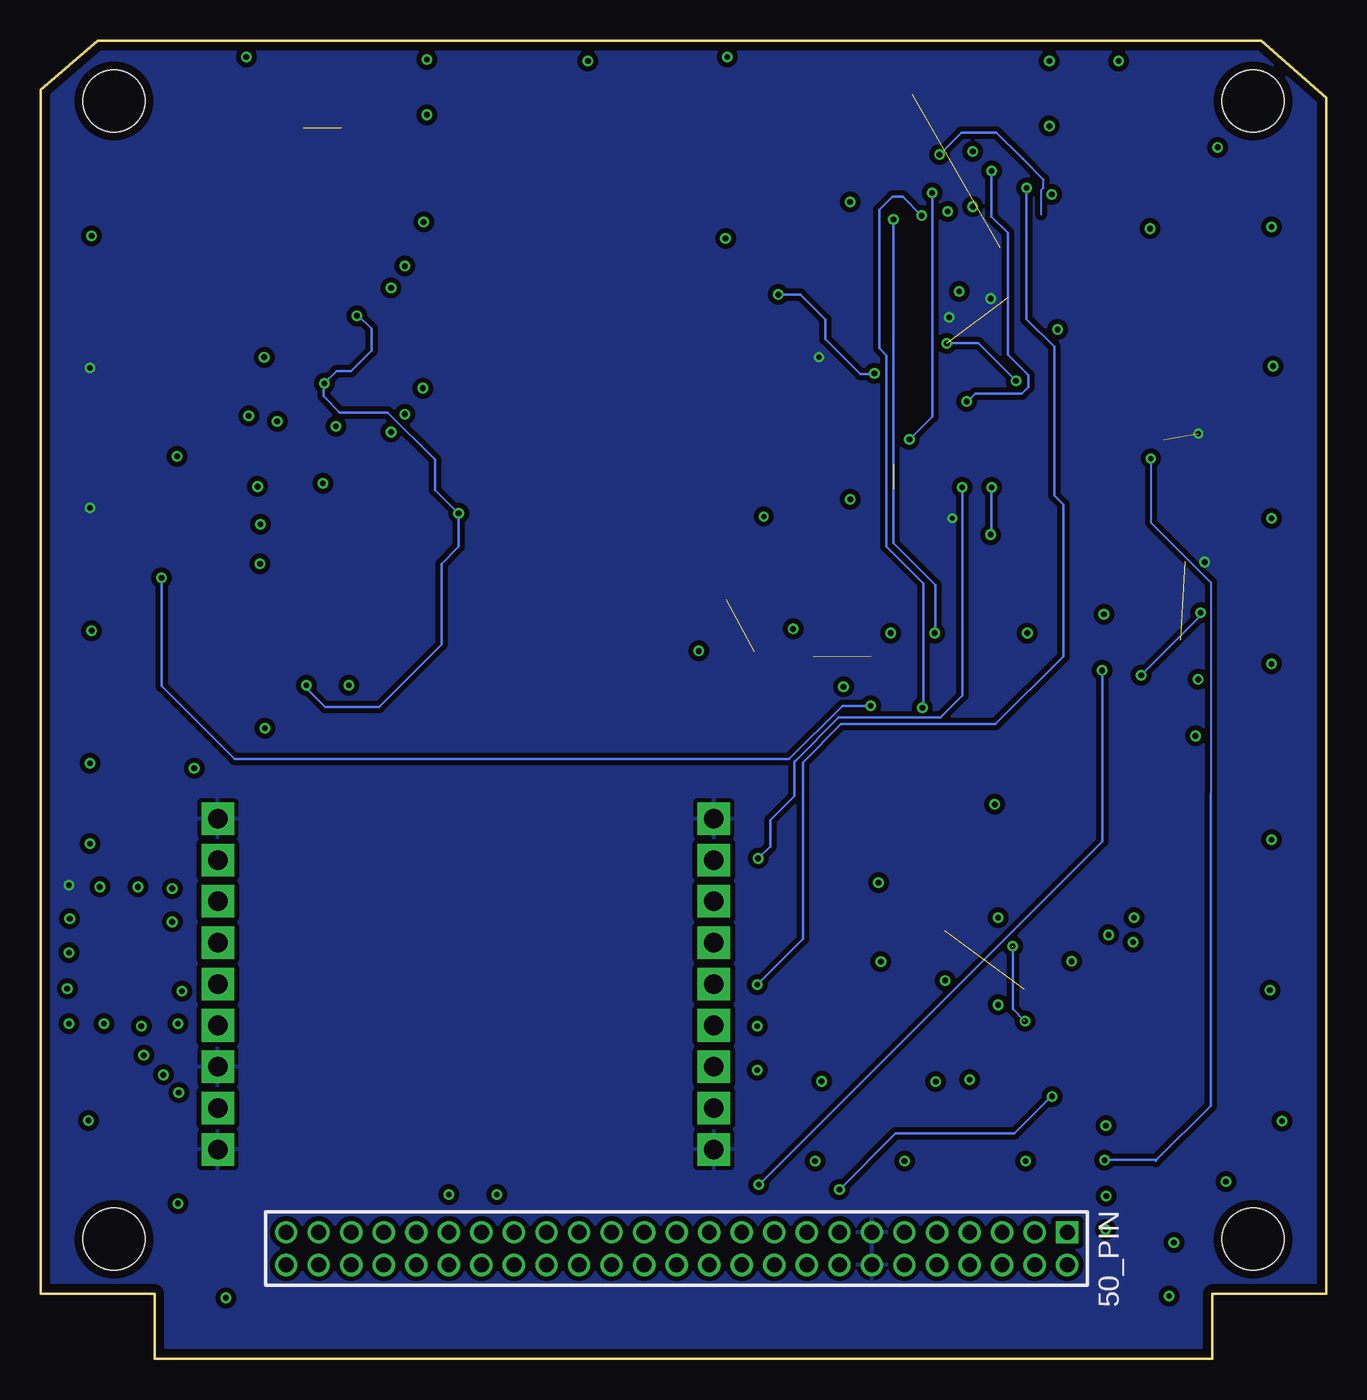
[diagram p7: board, bottom side, seen from below]

Size 79 x 81 mm. Coordinates in mm from the lower left corner, seen from the top.
Outline: 7,0 72,0 72,4 79,4 79,78 75.5,81 4,81 0,77.5 0,4 7,4 7,0
Copper layers (1+2*15+16): Top 0.018mm / dielectric 0.25mm / Route2 0.035mm / dielectric 1mm / Route15 0.035mm / dielectric 0.25mm / Bottom 0.018mm
Design rules "pban_5mil-l4 *": minimum track width 5mil, minimum drill 0.3mm, track to track 5mil, track to pad 0.229mm, pad to pad 5mil, via to via 5mil, smd to smd 5mil, copper to edge 0.5mm, drill to drill 0.5mm, minimum pad ring 0.15mm, minimum via ring 0.15mm, stop-mask expansion 0.05mm, vias tented up to drill 0.35mm, thermal gap 10mil
Holes 3.8 mm at 74.5,7.35 4.5,77.3 74.5,77.3 4.5,7.35

### Footprints (pad centres in the part's own frame; a part is rotated, then mirrored left to right if it is on the bottom)
2X25M = drill 0.914 square: 1 -24,-1 | drill 0.914: 2 -24,1; 3 -22,-1; 4 -22,1; 5 -20,-1; 6 -20,1; 7 -18,-1; 8 -18,1; 9 -16,-1; 10 -16,1; 11 -14,-1; 12 -14,1; 13 -12,-1; 14 -12,1; 15 -10,-1; 16 -10,1; 17 -8,-1; 18 -8,1; 19 -6,-1; 20 -6,1; 21 -4,-1; 22 -4,1; 23 -2,-1; 24 -2,1; 25 0,-1; 26 0,1; 27 2,-1; 28 2,1; 29 4,-1; 30 4,1; 31 6,-1; 32 6,1; 33 8,-1; 34 8,1; 35 10,-1; 36 10,1; 37 12,-1; 38 12,1; 39 14,-1; 40 14,1; 41 16,-1; 42 16,1; 43 18,-1; 44 18,1; 45 20,-1; 46 20,1; 47 22,-1; 48 22,1; 49 24,-1; 50 24,1
SML0603 = smd 0.8 x 0.8: A 0.75,0; C -0.75,0
C0603 = smd 1.1 x 1: 1 -0.85,0; 2 0.85,0
C0805 = smd 1.3 x 1.5: 1 -0.95,0; 2 0.95,0
SOIC127P1032X265-16N = smd 1.925 x 0.7: 1 -4.712,4.445; 2 -4.712,3.175; 3 -4.712,1.905; 4 -4.712,0.635; 5 -4.712,-0.635; 6 -4.712,-1.905; 7 -4.712,-3.175; 8 -4.712,-4.445; 9 4.712,-4.445; 10 4.712,-3.175; 11 4.712,-1.905; 12 4.712,-0.635; 13 4.712,0.635; 14 4.712,1.905; 15 4.712,3.175; 16 4.712,4.445
RAB_ACCESS = smd 2.2 x 0.76: P$1 -0.15,-0.635; P$2 3.55,-0.635; P$3 -0.15,-1.905; P$4 3.55,-1.905; P$5 -0.15,-3.175; P$6 3.55,-3.175; P$7 -0.15,-4.445; P$8 3.55,-4.445; P$9 -0.15,-5.715; P$10 3.55,-5.715; P$11 -0.15,-6.985; P$12 3.55,-6.985; P$13 -0.15,-8.255; P$14 3.55,-8.255; P$15 -0.15,-9.525; P$16 3.55,-9.525; P$17 -0.15,-10.795; P$18 3.55,-10.795; P$19 -0.15,-12.065; P$20 3.55,-12.065; P$21 -0.15,-13.335; P$22 3.55,-13.335; P$23 -0.15,-14.605; P$24 3.55,-14.605
L2012C = smd 1 x 1: 1 -1,0; 2 1,0
QFP50P1200X1200X120-64N = smd 1.475 x 0.3: 1 -5.738,3.75; 2 -5.738,3.25; 3 -5.738,2.75; 4 -5.738,2.25; 5 -5.738,1.75; 6 -5.738,1.25; 7 -5.738,0.75; 8 -5.738,0.25; 9 -5.738,-0.25; 10 -5.738,-0.75; 11 -5.738,-1.25; 12 -5.738,-1.75; 13 -5.738,-2.25; 14 -5.738,-2.75; 15 -5.738,-3.25; 16 -5.738,-3.75; 33 5.738,-3.75; 34 5.738,-3.25; 35 5.738,-2.75; 36 5.738,-2.25; 37 5.738,-1.75; 38 5.738,-1.25; 39 5.738,-0.75; 40 5.738,-0.25; 41 5.738,0.25; 42 5.738,0.75; 43 5.738,1.25; 44 5.738,1.75; 45 5.738,2.25; 46 5.738,2.75; 47 5.738,3.25; 48 5.738,3.75 | smd 0.3 x 1.475: 17 -3.75,-5.738; 18 -3.25,-5.738; 19 -2.75,-5.738; 20 -2.25,-5.738; 21 -1.75,-5.738; 22 -1.25,-5.738; 23 -0.75,-5.738; 24 -0.25,-5.738; 25 0.25,-5.738; 26 0.75,-5.738; 27 1.25,-5.738; 28 1.75,-5.738; 29 2.25,-5.738; 30 2.75,-5.738; 31 3.25,-5.738; 32 3.75,-5.738; 49 3.75,5.738; 50 3.25,5.738; 51 2.75,5.738; 52 2.25,5.738; 53 1.75,5.738; 54 1.25,5.738; 55 0.75,5.738; 56 0.25,5.738; 57 -0.25,5.738; 58 -0.75,5.738; 59 -1.25,5.738; 60 -1.75,5.738; 61 -2.25,5.738; 62 -2.75,5.738; 63 -3.25,5.738; 64 -3.75,5.738
MMCX_908_222101T = smd 1.778 x 1.397: P$1 0,-1.841; P$3 0,1.841 | smd 1.27 x 1.778: P$2 1.905,0; P$4 -1.905,0
SOT65P210X110-6N = smd 1.05 x 0.4: 1 -1.05,0.65; 2 -1.05,0; 3 -1.05,-0.65; 4 1.05,-0.65; 5 1.05,0; 6 1.05,0.65
SO08 = smd 0.6 x 2.2: 1 -1.905,-2.6; 2 -0.635,-2.6; 3 0.635,-2.6; 4 1.905,-2.6; 5 1.905,2.6; 6 0.635,2.6; 7 -0.635,2.6; 8 -1.905,2.6
SOT346-R = smd 0.7 x 0.9: 1 0.95,-1.05; 2 -0.95,-1.05; 3 0,1.05
R0603 = smd 1 x 1.1: 1 -0.85,0; 2 0.85,0
R0805 = smd 1.3 x 1.5: 1 -0.95,0; 2 0.95,0
TRIM_PVG3A200C01R00 = smd 1.1 x 0.9: 1 1.15,-1.65; 3 -1.15,-1.65 | smd 1.4 x 0.9: 2 0,1.65
CHIPLED_0603 = smd 0.8 x 0.8: A 0,-0.75; C 0,0.75
BIM1H = drill 1.2 pad 2 square: P$1 1.27,21.59; P$2 1.27,19.05; P$3 1.27,16.51; P$4 1.27,13.97; P$5 1.27,11.43; P$6 1.27,8.89; P$7 1.27,6.35; P$8 1.27,3.81; P$9 1.27,1.27; P$10 31.75,1.27; P$11 31.75,3.81; P$12 31.75,6.35; P$13 31.75,8.89; P$14 31.75,11.43; P$15 31.75,13.97; P$16 31.75,16.51; P$17 31.75,19.05; P$18 31.75,21.59
QFP80P1200X1200X120-44N = smd 1.5 x 0.5: 1 -5.9,4; 2 -5.9,3.2; 3 -5.9,2.4; 4 -5.9,1.6; 5 -5.9,0.8; 6 -5.9,0; 7 -5.9,-0.8; 8 -5.9,-1.6; 9 -5.9,-2.4; 10 -5.9,-3.2; 11 -5.9,-4; 23 5.9,-4; 24 5.9,-3.2; 25 5.9,-2.4; 26 5.9,-1.6; 27 5.9,-0.8; 28 5.9,0; 29 5.9,0.8; 30 5.9,1.6; 31 5.9,2.4; 32 5.9,3.2; 33 5.9,4 | smd 0.5 x 1.5: 12 -4,-5.9; 13 -3.2,-5.9; 14 -2.4,-5.9; 15 -1.6,-5.9; 16 -0.8,-5.9; 17 0,-5.9; 18 0.8,-5.9; 19 1.6,-5.9; 20 2.4,-5.9; 21 3.2,-5.9; 22 4,-5.9; 34 4,5.9; 35 3.2,5.9; 36 2.4,5.9; 37 1.6,5.9; 38 0.8,5.9; 39 0,5.9; 40 -0.8,5.9; 41 -1.6,5.9; 42 -2.4,5.9; 43 -3.2,5.9; 44 -4,5.9
SOT353-1 = smd 0.6 x 0.6: 1 -0.75,-0.9; 3 0.75,-0.9; 4 0.75,0.9; 5 -0.75,0.9 | smd 0.4 x 0.6: 2 0,-0.9
BIRDS5_LTC4361 = smd 0.25 x 0.7: 1 -0.675,-0.925; 2 -0.225,-0.925; 3 0.225,-0.925; 4 0.675,-0.925; 5 0.675,0.925; 6 0.225,0.925; 7 -0.225,0.925; 8 -0.675,0.925 | smd 1.37 x 0.54: 9 0,0
SM49 = smd 5.08 x 1.778: 1 -4.826,0; 2 4.826,0

### Placement (x,y rotation side)
50_PIN  39.92,6.77 180 bottom
APD1  63.62,75.62 180 top
APD2  63.62,73.07 180 top
APD3  63.62,70.52 180 top
APD4  63.62,67.97 180 top
C2  26,51.83 180 top
C3  4.12,18.76 89.6 top
C4  7.35,18.76 90 top
C5  10.2,22.75 270 top
C6  33.61,69.78 0 top
C7  32.54,53.17 0 top
C8  51.99,39.9 270 top
C9  51.79,49.53 270 top
C18  10.63,61.38 180 top
C21  8.64,53.17 270 top
C22  11.17,53.28 270 top
C23  13.58,53.31 270 top
C24  8.67,49.83 270 top
C25  11.12,49.73 270 top
C26  40.68,67.11 0 top
C27  14.62,49.34 90 top
C35  13.17,18.76 270 top
C36  9.54,31.03 180 top
C37  9.54,33.76 180 top
C38  35.94,40.35 180 top
C39  31.52,42.3 90 top
C40  27.99,42.34 90 top
C41  31.62,47.45 270 top
C42  50.62,54.45 270 top
C43  18.27,51 0 top
C44  21.87,45.9 0 top
C45  36.87,47.5 270 top
FM_SF  41.94,60.25 0 top
JP1  24.83,74.16 90 top
L5  10.21,18.76 270 top
MCU_SF  19.78,62.5 0 top
MMCX_908_222101T  73.77,24.07 270 top
MOS1  10.24,46.47 180 top
MOS2  15.42,27.78 359.3 top
OPAMP  66.02,60.95 90 top
Q1  9.85,40.2 0 top
Q2  22.38,25.34 90 top
Q3  22.37,30.15 90 top
R1  10.84,58.9 0 top
R2  10.84,56.5 0 top
R3  50.67,58.01 180 top
R4  34.54,62.49 270 top
R5  37.13,53.44 0 top
R7  10.68,65.63 0 top
R8  50.63,62.41 180 top
R9  34.6,58.59 270 top
R10  14.01,43.95 180 top
R11  50.64,65.01 180 top
R12  37.29,67.06 180 top
R13  10.66,63.51 0 top
R14  8.78,37.06 180 top
R17  16.07,33.14 90 top
R18  13.17,23.39 90 top
R19  18.59,33.22 270 top
R20  17.69,17.71 180 top
R21  59.67,75.62 0 top
R22  59.67,73.07 0 top
R23  59.67,70.52 0 top
R24  59.67,67.97 0 top
R25  61.72,65.1 0 top
R26  25.49,42.34 90 top
R27  18.17,46.2 0 top
R28  18.22,48.35 0 top
R29  21.82,48.3 0 top
R30  59.52,62.7 0 top
R31  36,43.45 180 top
R32  27.07,47 270 top
R33  34.22,47.45 90 top
R34  53.47,54.6 90 top
R35  72.37,59.95 90 top
R36  59.57,59.5 180 top
R37  72.37,63.25 90 top
R38  8.39,26.72 90 top
R39  10.41,26.72 90 top
SFD2  8.12,64.5 180 top
TRX1  69.39,34.46 180 top
U1  62.47,49.65 0 top
U2  25.71,54.22 90 top
U$1  17.62,23.39 90 top
U$3  9.87,43.5 270 top
XTAL1  29.82,61.76 270 top
XTAL2  46.68,45.69 90 top

### Tracks (layer width: path | path; a pad name or v marks a point on that pad's centre or on a via)
APRS_AFIN  (via drill 0.35)
  Top 0.127: 31.86,74 JP1.P$11
  Top 0.152: JP1.P$11 31.81,73.2 30.41,71.8 28.4,71.8 26.62,70.02 v26.6,70.02 | JP1.P$11 | v24.07,44.6 R26.2 25.49,43.32 v26.77,44.6 | C38.1 36.79,43.39 R31.1 38.52,43.45 v38.57,43.5 38.57,40.05 41.52,37.1 67.17,37.1 72.77,42.7 72.77,55.45 71.07,57.15 64.97,57.15 64.07,56.25 U1.37
  Route2 0.152: v26.77,44.6 27.82,45.65 37.67,45.65 38.57,44.75 v38.57,43.5
  Bottom 0.152: v26.6,70.02 26.6,50.13 24.02,47.55 24.02,44.65 v24.07,44.6
APRS_AFOUT  (via drill 0.35)
  Top 0.127: 18.24,44.63 18.27,44.66 v18.37,44.6 | U1.14 60.05,43.77 U1.14
  Top 0.152: JP1.P$13 33.08,73.09 32.25,72.26 31.48,72.26 30.32,71.1 v29.27,71.1 | v60.07,41.4 U1.14 60.05,43.77
  Top 0.2: R27.1 17.37,45.5 18.24,44.63 18.32,44.55
  Route2 0.152: v18.37,44.6 25.52,37.45 56.17,37.45 60.07,41.35 v60.07,41.4 60.07,52.45 54.42,58.1 54.42,65.55 | 54.42,65.55 54.42,65.7 | 54.42,65.55 49.47,70.5 39.52,70.5 38.92,71.1 v29.27,71.1
  Route15 0.127: v18.37,44.6 18.4,44.66 18.4,44.58
  Route15 0.2: 18.37,44.58 18.4,44.58 | v18.37,44.6 18.18,44.79
APRS_XTAL1
  Top 0.152: U1.8 56.57,48.03 54.85,48.03 53.77,46.95 53.77,45.9 51.99,44.12 C8.1 51.97,40.86 XTAL2.1
APRS_XTAL2
  Top 0.152: XTAL2.2 51.75,50.52 C9.1 53.39,50.48 55.02,48.85 U1.7
APRSDP_5V0  (via drill 0.35)
  Top 0.127: U1.38 63.23,55.58 U1.38 | U1.17 62.47,43.77 U1.17
  Top 0.152: C35.1 10.26,19.71 L5.1 C5.2 7.97,21.9 6.57,23.3 6.57,26 8.14,27.57 R38.2 R39.2 | R17.1 | R39.2 11.28,28.44 MOS2.1 14.38,29.56 16.07,31.25 R17.1 | R17.1 16.07,31.2 v20.17,27.1 | 63.27,58.89 U1.38 63.27,56.65 | 63.27,58.89 OPAMP.8 | U$1.3 19.37,23.61 | 19.37,23.61 20.22,23.61 28.47,15.36 37.58,15.36 TRX1.P$17 | R39.2 10.41,31.01 C36.1 C37.1 | v20.17,21.75 20.17,22.81 19.37,23.61 | R17.1 14.57,32.29 13.19,33.67 13.19,36.35 14.88,38.04 28.12,38.04 29.02,38.95 29.02,42.2 30.09,43.27 30.09,43.95 31.01,44.86 32.76,44.86 v32.77,44.85 | v32.77,44.85 32.77,44.9 36.97,44.9 45.67,53.6 48.62,53.6 50.27,51.95 v53.32,51.95 54.82,50.45 U1.5 | v62.67,41.4 62.67,43.55 U1.17 | v61.57,59.95 62.62,58.89 63.27,58.89 | v59.57,64.1 60.57,65.1 R25.1 | v32.77,44.85 32.77,42.65 31.57,41.45 C39.1
  Route2 0.152: v20.17,27.1 v20.17,21.75
  Bottom 0.127: 37.57,15.45 TRX1.P$17
  Bottom 0.152: v62.67,41.4 62.77,41.3 61.52,40.05 58.22,40.05 54.37,43.9 54.37,48.85 53.32,49.9 v53.32,51.95 54.77,53.4 54.77,55.25 57.67,58.15 60.62,58.15 61.62,59.15 61.62,59.95 v61.57,59.95 60.82,60.7 59.92,60.7 58.67,61.95 58.67,63.3 59.52,64.15 v59.57,64.1
APSF_MCU_RXB  (via drill 0.35)
  Top 0.127: 26.78,74 26.75,74.01 JP1.P$3 | 25.51,56.6 v25.62,56.5
  Top 0.152: v25.62,56.5 25.62,54.85 26.25,54.22 26.72,54.22 | JP1.P$3 | JP1.P$3 26.58,74.01 | v24.22,71.65 25.87,71.65 26.72,72.5 JP1.P$3
  Top 0.2: 26.72,54.22 U2.2 | JP1.P$3
  Bottom 0.152: v25.62,56.5 24.22,57.9 v24.22,71.65
APSF_MCU_RXB-2
  Top 0.2: MCU_SF.32 23.53,55.8 24.36,54.97 U2.4
APSF_MCU_TXB  (via drill 0.35)
  Top 0.152: MCU_SF.31 23.03,59.3 21.15,61.18 21.15,64.3 22.51,65.66 v22.57,65.6 | v23.77,74 23.78,74.01 JP1.P$1
  Route15 0.152: v22.57,65.6 22.57,72.8 v23.77,74
  Bottom 0.127: 18.65,73.74 17.38,72.47 17.38,71.96 17.51,71.84 17.51,70.31
  Bottom 0.152: 18.65,73.74 20.26,75.35 22.42,75.35 v23.77,74
AREF  (via drill 0.35)
  Top 0.127: 68.35,50.46 68.31,50.5 U1.29
  Top 0.152: R26.1 C40.1 27.99,40.18 28.02,40.15 v27.99,40.12 | v71.57,48 71.57,49.65 70.77,50.45 U1.29
  Bottom 0.152: v27.99,40.12 29.74,40.12 33.02,36.85 67.07,36.85 71.57,41.35 v71.57,48
AVCC  (via drill 0.35)
  Top 0.127: U1.27 | U1.27 | 68.31,48.85 U1.27
  Top 0.152: C3.1 C4.1 | C4.1 | C4.1 10.06,17.91 L5.2 13.59,14.38 v13.54,14.32 | v65.52,48.85 68.31,48.85
  Route2 0.152: v13.54,14.32 17.49,18.27 17.49,33.8 18.81,35.11 57.32,35.11 63.36,41.16 63.36,46.65 65.54,48.83 v65.52,48.85
DEBUG  (via drill 0.35)
  Top 0.152: MCU_SF.60 18.03,69.51 18.57,70.05 20.97,70.05 v21.72,70.8 | JP1.P$12 31.81,76.59 31.12,75.9 22.84,75.9 21.7,74.76 21.7,74.22 v21.72,74.2
  Route15 0.152: v21.72,74.2 v21.72,70.8
FM_RESET
  Top 0.2: FM_SF.3 35.05,62.16 R4.2
FM_W#
  Top 0.2: FM_SF.9 48.02,55.8 49.82,57.6 R3.2
GATE3  (via drill 0.35)
  Top 0.152: MOS1.2 11.94,46.47 12.42,46.95 12.42,47.55 12.07,47.9 8.32,47.9 7.72,47.3 v7.72,45.85 | v11.37,42 11.67,42.3 11.67,42.95 11.34,43.27 U$3.6
  Bottom 0.127: v11.37,42 11.28,42.12 7.6,45.8 v7.72,45.85
GATE4  (via drill 0.35)
  Top 0.152: MOS2.2 13.12,27.79 12.62,27.3 12.62,26.75 13.34,26.03 v13.37,26.05 | v15.64,24.43 15.64,23.9 15.93,23.61 U$1.6
  Route2 0.152: v13.37,26.05 14.47,24.95 15.07,24.95 15.62,24.4 v15.64,24.43
GND  (via drill 0.3, 0.35)  (7 unrouted)
  Top 0.127: 20.05,68.28 MCU_SF.56 | 50_PIN.13 27.92,7.7 27.92,7.67 | 17.53,56.85 17.51,56.85 MCU_SF.20 | 27.92,5.92 50_PIN.14 | U1.28 68.41,49.59 68.43,49.61 U1.28 | 63.35,44.53 63.35,43.77 U1.18
  Top 0.152: MCU_SF.20 | MCU_SF.20 17.53,56.85 17.53,57.58 17.75,57.8 17.77,57.8 17.82,57.85 19.82,57.85 20.03,57.64 MCU_SF.25 | U$3.1 9.4,44.17 9.6,43.98 9.6,43.77 U$3.9 9.87,42.64 9.99,42.52 10.13,42.52 10.63,42.02 10.63,41.7 10.83,41.5 10.83,40.56 10.8,40.53 Q1.1 | v23.17,64 24.42,62.75 MCU_SF.41 | MCU_SF.56 | C18.2 9.77,62.26 9.85,62.34 12.85,62.34 12.9,62.3 13.99,62.3 MCU_SF.9 | MCU_SF.20 17.53,55 14.99,52.46 C23.2 | R37.2 72.32,64.15 | MCU_SF.56 20.03,65.7 20.6,65.13 v20.62,65.15
  Top 0.305: 50_PIN.13 50_PIN.14
  other vias: 31.17,61.55 22.97,51.65 7.87,56.85 7.47,48.96 75.97,60.9 75.97,52.3 77.27,29.1
  pour Top (isolate 0.305): -9.09,81.6 86.17,81.6 86.17,-0.9 -9.09,-0.9
  pour Bottom (isolate 0.305): -9.43,81.85 86.62,81.85 86.67,81.9 86.67,-1.2 -9.43,-1.2 -9.48,-1.25 -9.48,81.8
  pour Route15 (isolate 0.305): -9.73,82.8 87.32,82.8 87.32,-1.45 -9.68,-1.45 -9.68,82.75
HOLD
  Top 0.2: R12.2 36.44,65.48 FM_SF.1
LED
  Top 0.2: MCU_SF.3 11.91,65.25 R7.2
LED2_GRN  (via drill 0.35)
  Top 0.127: U1.41 60.95,55.46 60.94,55.45 U1.41
  Top 0.152: U1.41 v60.87,57.3 | v55.47,69.85 55.47,71.65 56.92,73.1 58.79,73.1 R22.1
  Route2 0.152: v60.87,57.3 60.87,64.45 v55.47,69.85
LED3_YLW  (via drill 0.35)
  Top 0.127: U1.42 60.05,55.58 U1.42
  Top 0.152: U1.42 60.07,56.75 59.22,57.6 57.07,57.6 v56.62,58.05 | v56.62,67.15 56.62,68.32 R23.1
  Route2 0.152: v56.62,58.05 v56.62,67.15
LED4_BLU  (via drill 0.35)
  Top 0.127: 59.16,55.58 U1.43
  Top 0.152: U1.43 59.27,56.7 59.02,56.95 v57.47,56.95 | v57.47,65.8 57.47,66.62 R24.1
  Route2 0.152: v57.47,56.95 v57.47,65.8
MB_DIO_APRSDP_5V0  (via drill 0.35)
  Top 0.152: 50_PIN.39 v53.92,10.1 | v27.52,29.25 23.47,29.25 Q3.2
  Route2 0.152: v53.92,10.1 42.22,21.8 34.77,21.8 29.87,26.7 29.77,26.8 27.52,29.05 v27.52,29.25
MB_DIO_SFWARD_3V3  (via drill 0.35)
  Top 0.152: 23.37,24.32 Q2.2 23.52,24.4 | 50_PIN.40 53.92,4.45 53.32,3.85 51.97,3.85 50.92,4.9 50.92,10.05 v50.97,10.1 | v27.37,24.4 23.52,24.4 | Q1.2 v8.03,38.28 v8.04,38.27 | v23.42,23.25 23.42,24.3 23.52,24.4
  Top 0.2: Q1.2 8.7,38.95
  Route2 0.152: v50.97,10.1 41.87,19.2 34.72,19.2 29.52,24.4 v27.37,24.4
  Route15 0.152: v8.04,38.27 11.27,35.05 17.52,35.05 20.97,31.6 20.97,24.4 22.12,23.25 v23.42,23.25
  Bottom 0.127: 53.83,5.67 50_PIN.40
MB_SF_RX
  Top 0.152: 21.24,80.28 21.27,80.3 32.47,80.3 33.08,79.69 JP1.P$14 | JP1.P$14 33.08,79.65 | JP1.P$14 33.08,78.66
  Top 0.2: 21.27,80.3 21.24,80.28 19.18,78.21 19.18,75.41 15.07,71.3 15.07,66.7 14.6,66.23 14.02,66.23 MCU_SF.1
MB_SF_TX
  Top 0.152: JP1.P$16 34.35,76.54 33.29,75.48 23.61,75.48 22.53,74.4 22.53,72.8
  Top 0.2: MCU_SF.2 14.92,65.75 15.42,66.25 15.42,69.25 16.62,70.45 20.18,70.45 22.53,72.8 | JP1.P$16 34.35,76.56 35.03,75.88 40.02,75.88
MCLR  (via drill 0.3, 0.35)
  Top 0.127: JP1.P$19 36.94,74 36.9,74 | v10.78,55.33 12.05,55.33 15.09,58.38
  Top 0.152: JP1.P$19 36.9,74.5 36.9,74 | v13.62,12.2 17.92,7.9 50_PIN.3 | JP1.P$19 36.89,68.85 v36.92,68.85 | MCU_SF.7 15.27,63.25 | 15.27,63.25 16.67,61.85 16.67,59.95 15.09,58.38 | v16.52,63.25 15.27,63.25
  Top 0.2: MCU_SF.7 12.77,63.25 12.51,63.51 R13.2
  Route2 0.152: v36.92,68.85 34.42,66.35 19.67,66.35 16.57,63.25 v16.52,63.25
  Bottom 0.127: 7.09,34.75 7.09,47.71 10.78,51.39 v10.78,55.33 | 17.89,7.83 50_PIN.3
  Bottom 0.152: 7.09,34.75 7.09,15.55 10.43,12.21 | 10.43,12.21 10.48,12.16 | v13.62,12.2 13.6,12.21 10.43,12.21
N$1  (via drill 0.35)
  Top 0.127: 65.61,55.49 U1.35 65.64,55.45 65.61,55.49
  Top 0.152: R38.1 9.49,24.77 10.92,24.77 11.81,25.66 v11.87,25.6 | v65.67,53.6 65.61,53.66 65.61,55.49
  Route2 0.152: v11.87,25.6 12.92,26.65 12.92,31.7 17.27,36.05 56.87,36.05 61.97,41.15 61.97,46.7 66.62,51.35 66.62,52.7 65.72,53.6 v65.67,53.6
N$2
  Top 0.2: C18.1 12.04,61.38 12.41,61.75 MCU_SF.10
N$3  (via drill 0.35)
  Top 0.127: U1.30 68.28,51.17 68.31,51.14 U1.30
  Top 0.152: R39.1 10.59,25.87 v11.82,27.1 | v65.49,51.27 68.17,51.27 68.28,51.17
  Route2 0.152: v11.82,27.1 11.82,31.75 16.92,36.85 56.72,36.85 61.07,41.2 61.07,46.8 65.52,51.25 v65.49,51.27
N$4  (via drill 0.35)
  other vias: 70.52,16.35
N$5  (via drill 0.35)
  other vias: 71.47,17.45
N$6  (via drill 0.35)
  other vias: 72.67,18.65
N$7
  Top 0.2: MCU_SF.14 12.54,59.75 R1.2
N$8
  Top 0.2: MCU_SF.15 13.07,59.25 12.72,58.9 12.72,57.53 R2.2
N$9  (via drill 0.35)
  other vias: 72.82,20.45
N$10
  Top 0.2: R32.3 22.82,48.15 R29.2
N$11
  Top 0.2: R7.1 8.5,65.63 SFD2.A
N$12  (1 unrouted)
N$13
  Top 0.152: R22.2 APD2.A
N$14
  Top 0.152: R23.2 APD3.A
N$15
  Top 0.152: R24.2 APD4.A
N$16
  Top 0.2: R27.2 19.02,46.5 17.37,48.15 R28.1 17.37,50.95 C43.1
N$17
  Top 0.2: C44.1 20.97,45.95 R29.1 19.12,48.3 R28.2
N$18
  Top 0.152: 48.67,54.25 49.57,54.25 C42.1
  Top 0.2: 48.67,54.25 43.12,54.25 37.22,48.35 C45.1 36.82,48.3 R33.2
N$19
  Top 0.2: R33.1 C41.2
N$20
  Top 0.152: R37.1 R35.2 71.88,60.31 OPAMP.2
N$21
  Top 0.152: R30.2 60.52,62.86 OPAMP.5 63.47,62.91 63.47,64.2 R25.2
N$22
  Top 0.2: C41.1 30.37,48.3 29.07,47 R32.2
N$23  (via drill 0.35)
  other vias: 75.12,20.6
N$24  (via drill 0.35)
  other vias: 77.27,20.6
N$25  (via drill 0.35)
  other vias: 77.37,22.75
N$26  (via drill 0.35)
  other vias: 77.27,24.95
N$27  (via drill 0.35)
  other vias: 77.22,27.05
N$29  (via drill 0.35)
  other vias: 75.37,29
N$30  (via drill 0.35)
  other vias: 73.02,29
N$31  (via drill 0.35)
  other vias: 70.92,28.9
N$32  (via drill 0.35)
  other vias: 70.92,26.85
N$33  (via drill 0.35)
  other vias: 70.57,20.6
N$34  (via drill 0.35)
  other vias: 70.32,22.6
N$35  (via drill 0.35)
  other vias: 3.37,69.55
N$36  (via drill 0.35)
  other vias: 3.27,61
N$37  (via drill 0.35)
  other vias: 45.37,79.75
N$38  (via drill 0.35)
  other vias: 3.37,51.65
N$39  (via drill 0.35)
  other vias: 3.37,42.7
N$40  (via drill 0.35)
  other vias: 3.37,31.9
N$41  (via drill 0.35)
  other vias: 3.47,22.65
N$42  (via drill 0.35)
  other vias: 70.57,9.55
N$43  (via drill 0.35)
  other vias: 67.62,3.75
N$44  (via drill 0.35)
  other vias: 2.72,14.6
N$45  (via drill 0.35)
  other vias: 6.17,10.9
N$46  (via drill 0.35)
  other vias: 9.37,7.15
N$47  (via drill 0.35)
  other vias: 9.67,3.85
N$48  (via drill 0.35)
  other vias: 55.27,79.85
N$49  (via drill 0.35)
  other vias: 66.37,80
N$50  (via drill 0.35)
  other vias: 75.87,69
N$53  (via drill 0.35)
  other vias: 75.87,44.75
N$54  (via drill 0.35)
  other vias: 75.97,36.6
N$55  (via drill 0.35)
  other vias: 75.97,31.65
N$56  (via drill 0.35)
  other vias: 76.07,14.65
N$57  (via drill 0.35)
  other vias: 65.22,38.75
N$58  (via drill 0.35)
  other vias: 69.57,36.3
N$70  (via drill 0.35)
  other vias: 18.47,12.15
N$71  (via drill 0.35)
  other vias: 25.92,12.15
N$72  (via drill 0.35)
  other vias: 31.42,12.15
N$73  (via drill 0.35)
  other vias: 31.02,17.05
N$78  (via drill 0.35)
  other vias: 6.67,74.45
N$80  (via drill 0.35)
  other vias: 12.77,79.75
N$81  (via drill 0.35)
  other vias: 17.02,79.75
N$82  (via drill 0.35)
  other vias: 17.02,75.75
N$84  (via drill 0.35)
  other vias: 10.82,69.45
N$88  (via drill 0.35)
  other vias: 36.82,80
N$100  (via drill 0.35)
  other vias: 55.27,76.45
ON3
  Top 0.152: U$3.4 9.85,41.92 9.85,41.15
  Top 0.2: Q1.3 9.85,41.15 9.85,37.28 R14.1
ON4  (via drill 0.35)  (2 unrouted)
  Top 0.152: Q3.3 21.32,25.35 Q2.3 19.33,25.34 19.32,25.35 | R20.1 18.54,20.77 18.57,20.8 | U$1.4 19.27,24.79 v19.27,25.35
  Bottom 0.152: v19.27,25.35 19.27,21.5 v18.52,20.75
OPAMP_A+  (via drill 0.35)
  Top 0.152: C42.2 53.32,53.6 R34.1 55.47,55.75 55.47,59.65 v55.52,59.65 | v65.27,61.55 68.58,61.55 OPAMP.3
  Route15 0.152: v55.52,59.65 57.42,61.55 v65.27,61.55
OSC1
  Top 0.152: XTAL1.1 29.82,63.85 28.22,62.25 MCU_SF.40
  Top 0.254: C6.1 30.81,69.78 29.82,68.79 XTAL1.1
OSC2
  Top 0.152: MCU_SF.39 28.12,61.75 29.82,60.05 29.82,56.8
  Top 0.254: XTAL1.2 29.82,56.8 29.82,54.28 30.93,53.17 C7.1
PA1  (via drill 0.35)
  Top 0.127: U1.36 64.88,55.58 U1.36
  Top 0.152: R17.2 16.15,34.07 R19.1 v20.37,34.07 20.47,34.07 | v70.62,55.45 69.22,56.85 65.37,56.85 64.88,56.36 64.88,55.58
  Route2 0.152: v20.37,34.07 57.08,34.07 64.06,41.05 69.17,41.05 70.66,42.55 70.66,55.45 v70.62,55.45
PD0_RXA  (via drill 0.35)
  Top 0.152: JP1.P$7 29.27,73.06 28.76,72.55 27.82,72.55 25.52,70.25 v24.87,70.25 | v21.92,17.15 21.92,10.4 20.92,9.4 20.92,6.77 50_PIN.8
  Route15 0.152: v24.82,40 24.82,19.95 21.97,17.1 v21.92,17.15
  Bottom 0.152: v24.87,70.25 26.02,71.4 26.67,71.4 27.47,70.6 27.47,62.1 27.02,61.65 27.02,49.9 24.77,47.65 24.77,40 v24.82,40
PD1_TXA  (via drill 0.35)
  Top 0.152: v23.27,70.5 23.67,70.9 25.73,70.9 28,73.17 JP1.P$5 | v23.99,17.02 23.99,7.84 50_PIN.9
  Route15 0.152: v23.27,70.5 28.57,65.2 28.57,44.95 30.37,43.15 30.37,30.7 28.12,28.45 28.12,21.3 23.92,17.1 v23.99,17.02
  Bottom 0.127: 23.86,7.83 50_PIN.9
PGC  (via drill 0.3, 0.35)
  Top 0.127: JP1.P$17 35.67,74.38 35.61,74.38 35.59,74.38 | 15.98,7.83 50_PIN.1
  Top 0.152: MCU_SF.42 26.47,63.25 27.17,63.95 27.17,68.65 28.62,70.1 30.66,70.1 31.81,71.25 34.69,71.25 35.59,72.15 | 35.59,72.15 35.59,72.16 | 35.59,72.15 35.62,72.18 JP1.P$17 | JP1.P$17 35.62,72.19 35.59,72.16 | JP1.P$17 35.62,72.1 | v34.56,51.76 34.56,54.1 33,55.66 33,66.2 36.47,69.67 36.47,71.28 35.59,72.16 | v13.52,10 13.52,8.9 14.67,7.75 15.9,7.75 50_PIN.1
  Top 0.2: JP1.P$17 35.61,74.38 35.61,74.51 | 35.59,72.16 35.59,74.38 35.59,74.51
  Route15 0.152: v34.56,51.76 34.56,45.3 32.72,43.45 | 32.72,43.45 32.69,43.43 | 32.72,43.45 32.72,31.1 29.59,27.98 29.59,20.5 24.75,15.66 19.37,15.66 13.61,9.91 v13.52,10
PGD  (via drill 0.35)
  Top 0.127: 34.65,75.01 34.4,75.01 JP1.P$15
  Top 0.152: 34.35,75.04 JP1.P$15 34.35,73 32.95,71.6 31.57,71.6 30.44,70.47 28.37,70.47 21.97,64.07 21.97,61.75 22.97,60.75 MCU_SF.37 26.67,60.75 27.72,59.7 27.72,54.4 29.27,52.85 v29.24,52.83
  Route2 0.152: v29.24,52.83 23.67,47.25 18.02,47.25 14.87,44.1 14.87,36.85 9.67,31.65 9.67,11.85 v13.57,7.95
  Route15 0.152: v13.57,7.95 15.75,5.77 50_PIN.2
RSSI  (via drill 0.35)
  Top 0.127: 37.57,30.69 TRX1.P$11 | 21.44,75.27 21.45,75.26
  Top 0.152: v20.57,73 20.57,74.38 21.45,75.26 22.41,76.22 27.56,76.22 28,76.66 JP1.P$6 | v22.09,58.83 21.02,57.75 21.02,56.77 MCU_SF.27 | v34.92,30.75 37.51,30.75 37.57,30.69
  Top 0.2: v22.37,53.55 22.37,53.6 21.03,54.94 MCU_SF.27
  Bottom 0.152: v20.57,73 20.57,70.2 19.57,69.2 19.57,61.7 18.32,60.45 18.32,59.7 18.72,59.3 21.57,59.3 22.07,58.8 v22.09,58.83 | v22.37,53.55 22.37,40.75 23.72,39.4 29.97,39.4 32.59,36.77 32.67,36.7 32.67,34.6 34.17,33.1 34.17,31.5 v34.92,30.75
SENSE3
  Top 0.152: MOS1.6 9.19,45.38 9.52,45.05 11.96,45.05 R10.2 12.83,43.73 U$3.7
SENSE4
  Top 0.152: U$1.7 15.66,23.16 14.48,24.34 R18.2 14.64,25.8 17.67,25.8 18.22,26.35 18.22,27.6 17.4,28.42 MOS2.6
SFWARD_3V3_2  (via drill 0.35)  (1 unrouted)
  Top 0.127: MCU_SF.26 20.56,56.85 20.53,56.85
  Top 0.152: C2.2 24.81,52.17 U2.5 23.99,53.47 23.27,52.75 22.27,52.75 20.53,54.49 MCU_SF.26 | 16.98,57.63 16.8,57.8 16.25,57.8 16.07,57.63 16.07,56.81 MCU_SF.17 16.03,57.61 | 16.98,57.63 16.98,57.1 16.98,56.81 MCU_SF.19 | MCU_SF.26 20.53,56.85 20.53,59.44 19.87,60.1 v19.07,60.1 18.22,60.1 16.98,58.86 16.98,57.63 | MCU_SF.26 | v23.32,62.4 23.37,62.4 24.52,61.25 MCU_SF.38 27.07,61.25 v27.77,60.55 | v7.87,41.75 7.57,42.05 7.57,42.8 8.04,43.27 U$3.3 | v13.67,45.75 11.36,45.75 MOS1.1 | JP1.P$9 30.54,72.85 29.93,72.24 27.91,72.24 25.27,69.6 19.97,69.6 19.53,69.16 MCU_SF.57 19.53,65.25 | R12.1 39.78,67.06 C26.1 39.83,66.9 40.83,65.9
  Top 0.2: R3.1 51.52,62.37 R8.1 R11.1 51.49,65.58 51.17,65.9 40.83,65.9 | 34.47,63.34 R4.1 37.14,63.34 FM_SF.2 38.29,63.42 38.82,63.95 38.82,66.38 R12.1 | 34.47,63.34 34.01,63.34 33.37,62.7 33.37,60.67 R9.1 34.11,59.44 33.37,58.7 33.37,56.15 36.08,53.44 R5.1 | MCU_SF.17 16.03,55.06 15.13,54.16 C23.1 13.55,54.13 C22.1 11.06,54.02 C21.1 | C21.1 8.24,54.02 7.57,53.35 7.57,51.35 8.24,50.68 C24.1 11.02,50.68 C25.1 11.94,50.58 13.17,49.35 13.17,46.45 12.54,45.82 MOS1.1 | R13.1 9.32,63.51 8.64,62.83 C21.1 | v33.67,65.4 34.47,64.6 34.47,63.34 | C27.1 14.62,46.7 v13.67,45.75
  Bottom 0.152: v33.67,65.4 32.32,65.4 30.77,63.85 30.77,62.65 28.62,60.5 27.77,60.5 v27.77,60.55 | v23.32,62.4 21.37,62.4 v19.07,60.1
  pour Route2 (isolate 0.305): -9.03,-0.7 86.97,-0.7 86.97,82.3 -9.03,82.3
SPI_FM_CS
  Top 0.152: FM_SF.7 38.54,57.08 39.42,56.2 39.42,52.75 36.87,50.2 22.47,50.2 18.53,54.14 MCU_SF.22
  Top 0.2: FM_SF.7 35.29,57.08 34.63,57.74 R9.2
SPI_MISO
  Top 0.152: MCU_SF.23 19.03,54.14 22.57,50.6 36.47,50.6 37.98,52.11 R5.2 37.98,55.05 FM_SF.8
SPI_MOSI  (via drill 0.35)
  Top 0.152: FM_SF.15 44.79,63.42 42.82,61.45 42.82,54.75 37.57,49.5 21.72,49.5 20.62,50.6 v20.62,50.65 | v20.57,53.55 19.53,54.59 MCU_SF.24
  Top 0.2: FM_SF.15 47.54,63.42 48.56,62.41 R8.2
  Bottom 0.152: v20.57,53.55 20.57,50.7 v20.62,50.65
SPI_SCK
  Top 0.152: FM_SF.16 45.06,64.69 42.07,61.7 42.07,54.65 37.27,49.85 22.37,49.85 18.03,54.19 MCU_SF.21
  Top 0.2: FM_SF.16 49.47,64.69 R11.2
SUP_3V3_2  (via drill 0.35)
  Top 0.127: 11.16,36.02 11.17,36.1
  Top 0.152: R14.2 7.12,37.87 7.12,43.9 7.92,44.7 10.27,44.7 U$3.8 | 50_PIN.26 50_PIN.25 39.92,9.35 38.57,10.7 v34.87,10.7
  Top 0.2: R10.1 14.96,43.49 v13.77,42.3 12.02,40.55 12.02,36.95 11.17,36.1 8.37,36.1 7.93,36.54 R14.2
  Bottom 0.152: v34.87,10.7 13.77,31.8 v13.77,42.3
SUP_5V0  (via drill 0.35)
  Top 0.127: 29.95,5.67 50_PIN.16
  Top 0.152: R18.1 13.21,22.4 14.97,22.4 15.28,22.71 U$1.8 15.77,21.79 15.77,18.78 R20.2 v16.84,16.12 | 50_PIN.15 v29.92,10.4
  Top 0.254: 50_PIN.16 50_PIN.15
  Bottom 0.127: 29.95,7.83 50_PIN.15
  Bottom 0.152: v29.92,10.4 26.47,13.85 19.17,13.85 16.87,16.15 v16.84,16.12
TRX1
  Top 0.127: MMCX_908_222101T.P$1 71.86,23.96 71.86,19.13 68.18,15.45 TRX1.P$2
TRX1_AFOUT  (via drill 0.35)
  Top 0.127: 37.7,25.61 TRX1.P$13
  Top 0.152: v16.87,71.55 19.72,74.4 19.72,78.2 21.47,79.95 30.03,79.95 30.54,79.44 JP1.P$10 | v29.67,41.3 30.62,40.35 C38.2 32.65,37.91 32.65,27.85 34.96,25.54 37.63,25.54 37.7,25.61
  Route15 0.152: v16.87,71.55 16.87,66.5 27.87,55.5 27.87,44.5 29.67,42.7 v29.67,41.3
TRX1_RXSELECT  (via drill 0.35)
  Top 0.127: 61.65,55.57 61.56,55.47 61.58,55.45 U1.40 | 37.7,17.99 TRX1.P$16
  Top 0.152: R21.1 56.77,75.62 54.38,73.24 54.38,63.15 55.95,61.59 OPAMP.6 61.82,61.59 60.42,60.19 R36.1 61.67,58.25 U1.40 v61.67,53.8 | v34.97,17.75 37.44,17.75 TRX1.P$16
  Route15 0.152: v61.67,53.8 61.67,44.25 55.82,38.4 36.47,38.4 33.27,35.2 33.27,30.7 30.37,27.8 30.37,21.3 33.92,17.75 v34.97,17.75
TRX1_TXD  (via drill 0.35)
  Top 0.127: 20.05,75.14 20.07,75.14
  Top 0.152: v18.42,71.95 20.07,73.6 20.07,75.14 20.07,77.95 21.79,79.67 28.85,79.67 29.27,79.25 JP1.P$8 | R35.1 68.67,59.1 OPAMP.1 68.62,58.15 67.92,57.45 66.72,57.45 v66.22,57.95 | v34.97,23 37.61,23 TRX1.P$14
  Route2 0.152: v66.22,57.95 66.22,70.1 64.87,71.45 39.52,71.45 38.72,72.25 24.97,72.25 24.32,72.9 21.92,72.9 20.97,71.95 v18.42,71.95
  Bottom 0.152: v18.42,71.95 18.42,63.9 16.72,62.2 16.72,53.05 16.17,52.5 16.17,43.15 20.32,39 29.82,39 32.17,36.65 32.17,25.8 v34.97,23
TRX1_TXSELECT  (via drill 0.35)
  Top 0.127: 37.57,20.4 TRX1.P$15
  Top 0.152: OPAMP.7 64.87,60.31 65.25,59.93 65.25,58.45 64.43,57.63 v64.47,57.6 | v34.97,20.45 37.53,20.45 37.57,20.4
  Route2 0.152: v64.47,57.6 64.52,57.6
  Route15 0.152: 56.67,36.3 36.57,36.3 33.87,33.6 33.87,30.2 31.32,27.65 31.32,22.6 33.47,20.45 v34.97,20.45 | 56.67,36.3 56.87,36.3 | v64.47,57.6 64.47,44.1 56.67,36.3